# Altium project Dahlia Carrier Board.PrjPcb (part 1 of 4)
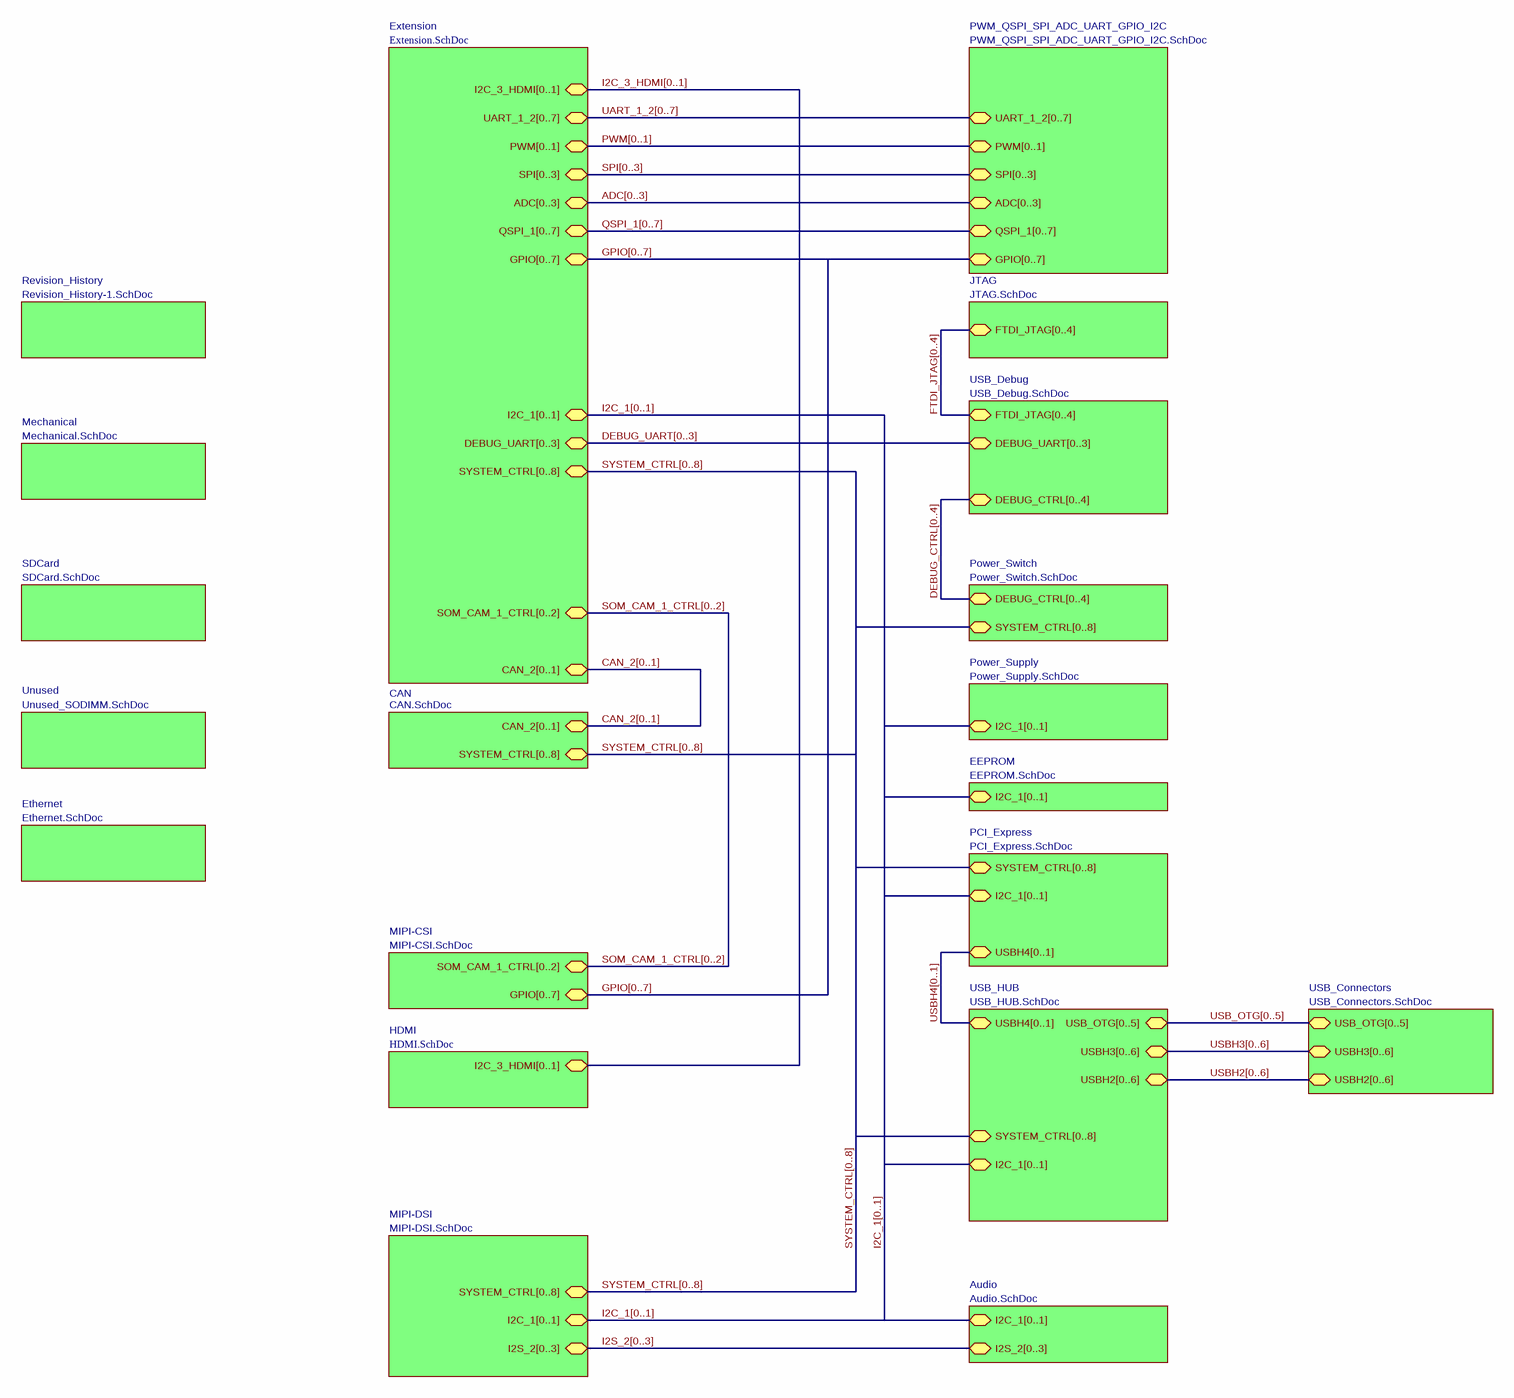
[diagram p0: Hardware_Architecture.SchDoc]
21 sheets, 885 parts. Net scope: global (net labels, ports and power ports of the same name join across sheets).
Board file: Dahlia Carrier Board.PcbDoc
Sheets:
  Hardware_Architecture.SchDoc
    Mechanical = Mechanical.SchDoc
    Revision_History = Revision_History-1.SchDoc
    CAN = CAN.SchDoc
    USB_HUB = USB_HUB.SchDoc
    USB_Connectors = USB_Connectors.SchDoc
    Power_Switch = Power_Switch.SchDoc
    SDCard = SDCard.SchDoc
    JTAG = JTAG.SchDoc
    Power_Supply = Power_Supply.SchDoc
    Ethernet = Ethernet.SchDoc
    PCI_Express = PCI_Express.SchDoc
    Audio = Audio.SchDoc
    MIPI-DSI = MIPI-DSI.SchDoc
    MIPI-CSI = MIPI-CSI.SchDoc
    PWM_QSPI_SPI_ADC_UART_GPIO_I2C = PWM_QSPI_SPI_ADC_UART_GPIO_I2C.SchDoc
    EEPROM = EEPROM.SchDoc
    USB_Debug = USB_Debug.SchDoc
    Extension = Extension.SchDoc
    Unused = Unused_SODIMM.SchDoc
    HDMI = HDMI.SchDoc

## Sheet Hardware_Architecture.SchDoc: Dahlia Carrier Board
size A3; Organization: Toradex AG; Address1: Ebenaustrasse 10; Address2: Horw; Address3: 6048; Address4: Switzerland; DocumentNumber: 1; Revision: V1.1; SheetNumber: 1; SheetTotal: 21; PageSetup: Record=PageOptions|CenterHorizontal=True|CenterVertical=True|PrintScale=0.73|XCorrection=1.00|YCorrection=1.00|PrintKind=0|BorderSize=5000000|LeftOffset=0|BottomOffset=0|Orientation=2|PaperLength=1000|PaperWidth=1000|Scale=100|PaperSource=7|PrintQuality=600|MediaType=1|DitherType=10|PaperKind=A4|PrintScaleMode=1

### Sub-sheets
Audio = Audio.SchDoc: I2C_1[0..1] (bidir), I2S_2[0..3] (bidir)
CAN = CAN.SchDoc: CAN_2[0..1] (bidir), SYSTEM_CTRL[0..8] (bidir)
EEPROM = EEPROM.SchDoc: I2C_1[0..1] (bidir)
Ethernet = Ethernet.SchDoc: no entries
Extension = Extension.SchDoc: ADC[0..3] (bidir), PWM[0..1] (bidir), SYSTEM_CTRL[0..8] (bidir), SPI[0..3] (bidir), DEBUG_UART[0..3] (bidir), CAN_2[0..1] (bidir), SOM_CAM_1_CTRL[0..2] (bidir), QSPI_1[0..7] (bidir), I2C_1[0..1] (bidir), UART_1_2[0..7] (bidir), I2C_3_HDMI[0..1] (bidir), GPIO[0..7] (bidir)
HDMI = HDMI.SchDoc: I2C_3_HDMI[0..1] (bidir)
JTAG = JTAG.SchDoc: FTDI_JTAG[0..4] (bidir)
Mechanical = Mechanical.SchDoc: no entries
MIPI-CSI = MIPI-CSI.SchDoc: GPIO[0..7] (bidir), SOM_CAM_1_CTRL[0..2] (bidir)
MIPI-DSI = MIPI-DSI.SchDoc: I2S_2[0..3] (bidir), SYSTEM_CTRL[0..8] (bidir), I2C_1[0..1] (bidir)
PCI_Express = PCI_Express.SchDoc: USBH4[0..1] (bidir), SYSTEM_CTRL[0..8] (bidir), I2C_1[0..1] (bidir)
Power_Supply = Power_Supply.SchDoc: I2C_1[0..1] (bidir)
Power_Switch = Power_Switch.SchDoc: DEBUG_CTRL[0..4] (bidir), SYSTEM_CTRL[0..8] (bidir)
PWM_QSPI_SPI_ADC_UART_GPIO_I2C = PWM_QSPI_SPI_ADC_UART_GPIO_I2C.SchDoc: PWM[0..1] (bidir), SPI[0..3] (bidir), ADC[0..3] (bidir), QSPI_1[0..7] (bidir), UART_1_2[0..7] (bidir), GPIO[0..7] (bidir)
Revision_History = Revision_History-1.SchDoc: no entries
SDCard = SDCard.SchDoc: no entries
Unused = Unused_SODIMM.SchDoc: no entries
USB_Connectors = USB_Connectors.SchDoc: USB_OTG[0..5] (bidir), USBH2[0..6] (bidir), USBH3[0..6] (bidir)
USB_Debug = USB_Debug.SchDoc: DEBUG_CTRL[0..4] (bidir), FTDI_JTAG[0..4] (bidir), DEBUG_UART[0..3] (bidir)
USB_HUB = USB_HUB.SchDoc: USB_OTG[0..5] (bidir), SYSTEM_CTRL[0..8] (bidir), I2C_1[0..1] (bidir), USBH2[0..6] (bidir), USBH4[0..1] (bidir), USBH3[0..6] (bidir)

### Buses and harness runs
bus ADC[0..3] = sheet Extension/ADC[0..3] = sheet PWM_QSPI_SPI_ADC_UART_GPIO_I2C/ADC[0..3]
bus CAN_2[0..1] = sheet CAN/CAN_2[0..1] = sheet Extension/CAN_2[0..1]
bus DEBUG_CTRL[0..4] = sheet Power_Switch/DEBUG_CTRL[0..4] = sheet USB_Debug/DEBUG_CTRL[0..4]
bus DEBUG_UART[0..3] = sheet Extension/DEBUG_UART[0..3] = sheet USB_Debug/DEBUG_UART[0..3]
bus FTDI_JTAG[0..4] = sheet JTAG/FTDI_JTAG[0..4] = sheet USB_Debug/FTDI_JTAG[0..4]
bus GPIO[0..7] = sheet Extension/GPIO[0..7] = sheet MIPI-CSI/GPIO[0..7] = sheet PWM_QSPI_SPI_ADC_UART_GPIO_I2C/GPIO[0..7]
bus I2C_1[0..1] = sheet Audio/I2C_1[0..1] = sheet EEPROM/I2C_1[0..1] = sheet Extension/I2C_1[0..1] = sheet MIPI-DSI/I2C_1[0..1] = sheet PCI_Express/I2C_1[0..1] = sheet Power_Supply/I2C_1[0..1] = sheet USB_HUB/I2C_1[0..1]
bus I2C_3_HDMI[0..1] = sheet Extension/I2C_3_HDMI[0..1] = sheet HDMI/I2C_3_HDMI[0..1]
bus I2S_2[0..3] = sheet Audio/I2S_2[0..3] = sheet MIPI-DSI/I2S_2[0..3]
bus PWM[0..1] = sheet Extension/PWM[0..1] = sheet PWM_QSPI_SPI_ADC_UART_GPIO_I2C/PWM[0..1]
bus QSPI_1[0..7] = sheet Extension/QSPI_1[0..7] = sheet PWM_QSPI_SPI_ADC_UART_GPIO_I2C/QSPI_1[0..7]
bus SOM_CAM_1_CTRL[0..2] = sheet Extension/SOM_CAM_1_CTRL[0..2] = sheet MIPI-CSI/SOM_CAM_1_CTRL[0..2]
bus SPI[0..3] = sheet Extension/SPI[0..3] = sheet PWM_QSPI_SPI_ADC_UART_GPIO_I2C/SPI[0..3]
bus SYSTEM_CTRL[0..8] = sheet CAN/SYSTEM_CTRL[0..8] = sheet Extension/SYSTEM_CTRL[0..8] = sheet MIPI-DSI/SYSTEM_CTRL[0..8] = sheet PCI_Express/SYSTEM_CTRL[0..8] = sheet Power_Switch/SYSTEM_CTRL[0..8] = sheet USB_HUB/SYSTEM_CTRL[0..8]
bus UART_1_2[0..7] = sheet Extension/UART_1_2[0..7] = sheet PWM_QSPI_SPI_ADC_UART_GPIO_I2C/UART_1_2[0..7]
bus USB_OTG[0..5] = sheet USB_Connectors/USB_OTG[0..5] = sheet USB_HUB/USB_OTG[0..5]
bus USBH2[0..6] = sheet USB_Connectors/USBH2[0..6] = sheet USB_HUB/USBH2[0..6]
bus USBH3[0..6] = sheet USB_Connectors/USBH3[0..6] = sheet USB_HUB/USBH3[0..6]
bus USBH4[0..1] = sheet PCI_Express/USBH4[0..1] = sheet USB_HUB/USBH4[0..1]

### Notes on the sheet
- Title
- Size:
- Date:
- A3
- Number:
- Time:
- Revision:
- Sheet
- of
- File:

## Sheet Mechanical.SchDoc: Dahlia Carrier Board
size A3; Organization: Toradex AG; Address1: Ebenaustrasse 10; Address2: Horw; Address3: 6048; Address4: Switzerland; DocumentNumber: 20; Revision: V1.1; SheetNumber: 20; SheetTotal: 21; PageSetup: Record=PageOptions|CenterHorizontal=True|CenterVertical=True|PrintScale=0.71|XCorrection=1.00|YCorrection=1.00|PrintKind=1|BorderSize=5000000|LeftOffset=0|BottomOffset=0|Orientation=2|PaperLength=1000|PaperWidth=1000|Scale=100|PaperSource=15|PrintQuality=600|MediaType=1|DitherType=10|PaperKind=A4|PrintScaleMode=1
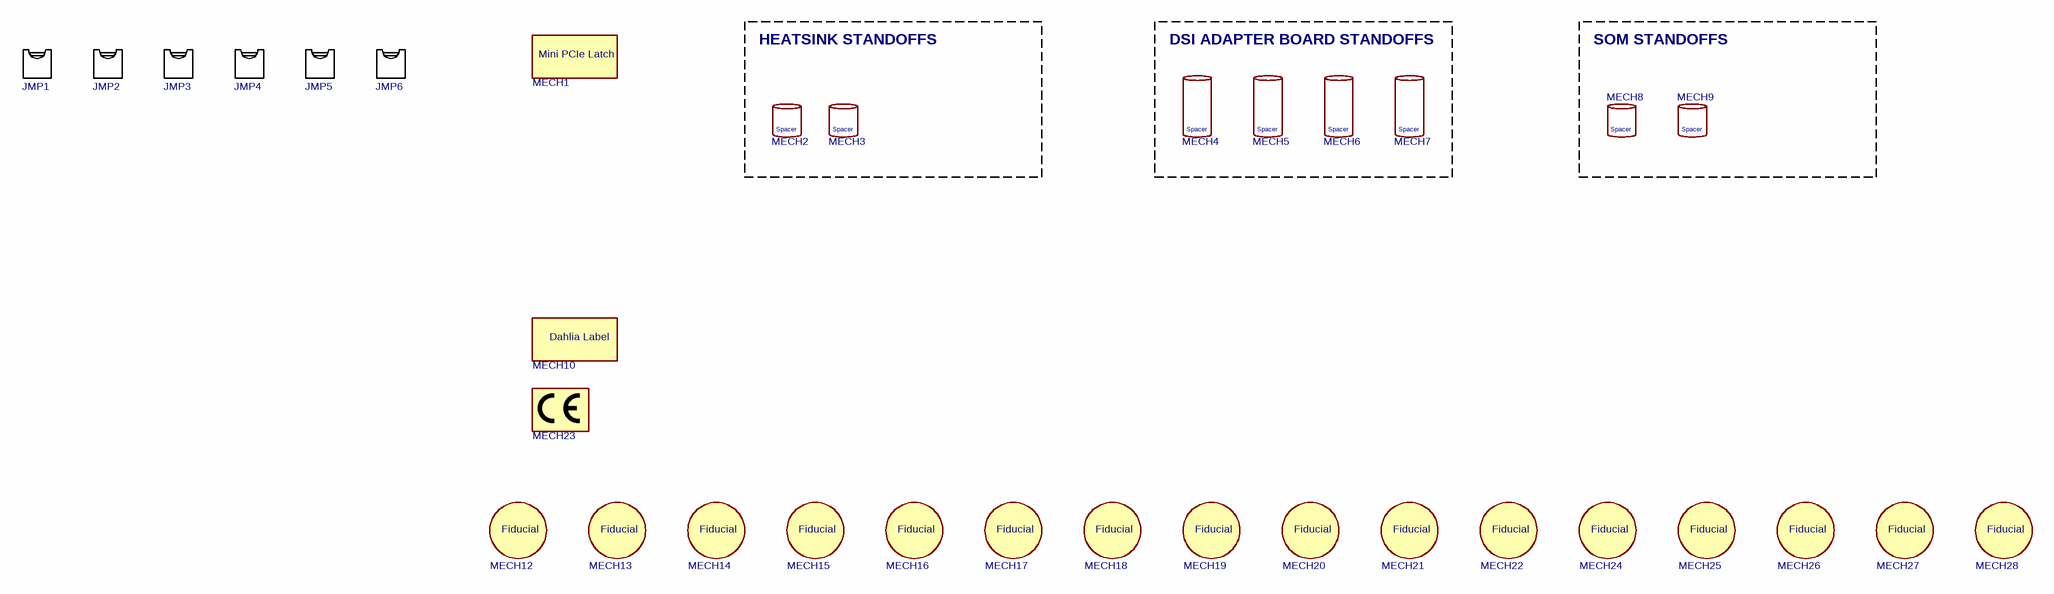
[diagram p1: Mechanical.SchDoc]

### Parts
JMP1  Shunt Jumper  (value not drawn)  (mechanical)
JMP2  Shunt Jumper  (value not drawn)  (mechanical)
JMP3  Shunt Jumper  (value not drawn)  (mechanical)
JMP4  Shunt Jumper  (value not drawn)  (mechanical)
JMP5  Shunt Jumper  (value not drawn)  (mechanical)
JMP6  Shunt Jumper  (value not drawn)  (mechanical)
MECH1  MECH-Mini-PCIe Latch  [MECH-Molex-48099-5701]  (value not drawn)
MECH2  Wurth-9774070243R  [MECH-Wurth-9774070243R]  (value not drawn)
MECH3  Wurth-9774070243R  [MECH-Wurth-9774070243R]  (value not drawn)
MECH4  Wurth-9774080360R  [MECH-Wurth-9774080360R]  (value not drawn)
MECH5  Wurth-9774080360R  [MECH-Wurth-9774080360R]  (value not drawn)
MECH6  Wurth-9774080360R  [MECH-Wurth-9774080360R]  (value not drawn)
MECH7  Wurth-9774080360R  [MECH-Wurth-9774080360R]  (value not drawn)
MECH8  Wurth-9774025243R  [MECH-Wurth-9774025243R]  (value not drawn)
MECH9  Wurth-9774025243R  [MECH-Wurth-9774025243R]  (value not drawn)
MECH10  Label-DahliaV1.1A  (value not drawn)  (mechanical)
MECH12  MECH-Fiducial  [T_Fiducial]  (value not drawn)  (no BOM)
MECH13  MECH-Fiducial  [T_Fiducial]  (value not drawn)  (no BOM)
MECH14  MECH-Fiducial  [T_Fiducial]  (value not drawn)  (no BOM)
MECH15  MECH-Fiducial  [T_Fiducial]  (value not drawn)  (no BOM)
MECH16  MECH-Fiducial  [T_Fiducial]  (value not drawn)  (no BOM)
MECH17  MECH-Fiducial  [T_Fiducial]  (value not drawn)  (no BOM)
MECH18  MECH-Fiducial  [T_Fiducial]  (value not drawn)  (no BOM)
MECH19  MECH-Fiducial  [T_Fiducial]  (value not drawn)  (no BOM)
MECH20  MECH-Fiducial  [T_Fiducial]  (value not drawn)  (no BOM)
MECH21  MECH-Fiducial  [T_Fiducial]  (value not drawn)  (no BOM)
MECH22  MECH-Fiducial  [T_Fiducial]  (value not drawn)  (no BOM)
MECH23  MECH-CE-Marking  [T_CE_Marking]  (value not drawn)  (no BOM)
MECH24  MECH-Fiducial  [T_Fiducial]  (value not drawn)  (no BOM)
MECH25  MECH-Fiducial  [T_Fiducial]  (value not drawn)  (no BOM)
MECH26  MECH-Fiducial  [T_Fiducial]  (value not drawn)  (no BOM)
MECH27  MECH-Fiducial  [T_Fiducial]  (value not drawn)  (no BOM)
MECH28  MECH-Fiducial  [T_Fiducial]  (value not drawn)  (no BOM)

### Blocks framed on the sheet
HEATSINK STANDOFFS: MECH2 MECH3
DSI ADAPTER BOARD STANDOFFS: MECH4-MECH7
SOM STANDOFFS: MECH8 MECH9

### Notes on the sheet
- Title
- Size:
- Date:
- A3
- Number:
- Time:
- Revision:
- Sheet
- of
- File:
- (in symbol MECH-Label-DahliaV1.1A) Dahlia Label
- (in symbol MECH-Molex-48099-5701) Mini PCIe Latch
- (in symbol MECH-Wurth-9774025243R) Spacer
- (in symbol MECH-Wurth-9774070243R) Spacer
- (in symbol MECH-Wurth-9774080360R) Spacer

### Library data of the parts
JMP1-JMP6 = MECH-Shunt-Jumper-Black-2.54mm: Manufacturer Name: JVE; Manufacturer Part No.: S1002-OPS60-01G
MECH1 = MECH-Molex-48099-5701: Mini-PCIe Latch; Manufacturer Name: Molex; Manufacturer Part No.: 48099-5701
MECH2 MECH3 = MECH-Wurth-9774070243R: Round Standoff M2x0.4 (7.00mm); Manufacturer Name: Wurth; Manufacturer Part No.: 9774070243R
MECH4-MECH7 = MECH-Wurth-9774080360R: Round Standoff M3x0.5 (8.00mm); Manufacturer Name: Wurth; Manufacturer Part No.: 9774080360R
MECH8 MECH9 = MECH-Wurth-9774025243R: Round Standoff M2x0.4 (2.50mm); Manufacturer Name: Wurth; Manufacturer Part No.: 9774025243R
MECH10 = MECH-Label-DahliaV1.1A: Label Sticker Dahlia V1.1A
MECH12-MECH22 MECH24-MECH28 = MECH-Fiducial: Fiducial
MECH23 = MECH-CE-Marking: CE Marking

## Sheet Revision_History-1.SchDoc: Dahlia Carrier Board
size A3; Organization: Toradex AG; Address1: Ebenaustrasse 10; Address2: Horw; Address3: 6048; Address4: Switzerland; DocumentNumber: 2; Revision: V1.1; SheetNumber: 2; SheetTotal: 21; PageSetup: Record=PageOptions|CenterHorizontal=True|CenterVertical=True|PrintScale=0.73|XCorrection=1.00|YCorrection=1.00|PrintKind=0|BorderSize=5000000|LeftOffset=0|BottomOffset=0|Orientation=2|PaperLength=1000|PaperWidth=1000|Scale=100|PaperSource=7|PrintQuality=-4|MediaType=1|DitherType=10|PaperKind=A4|PrintScaleMode=1
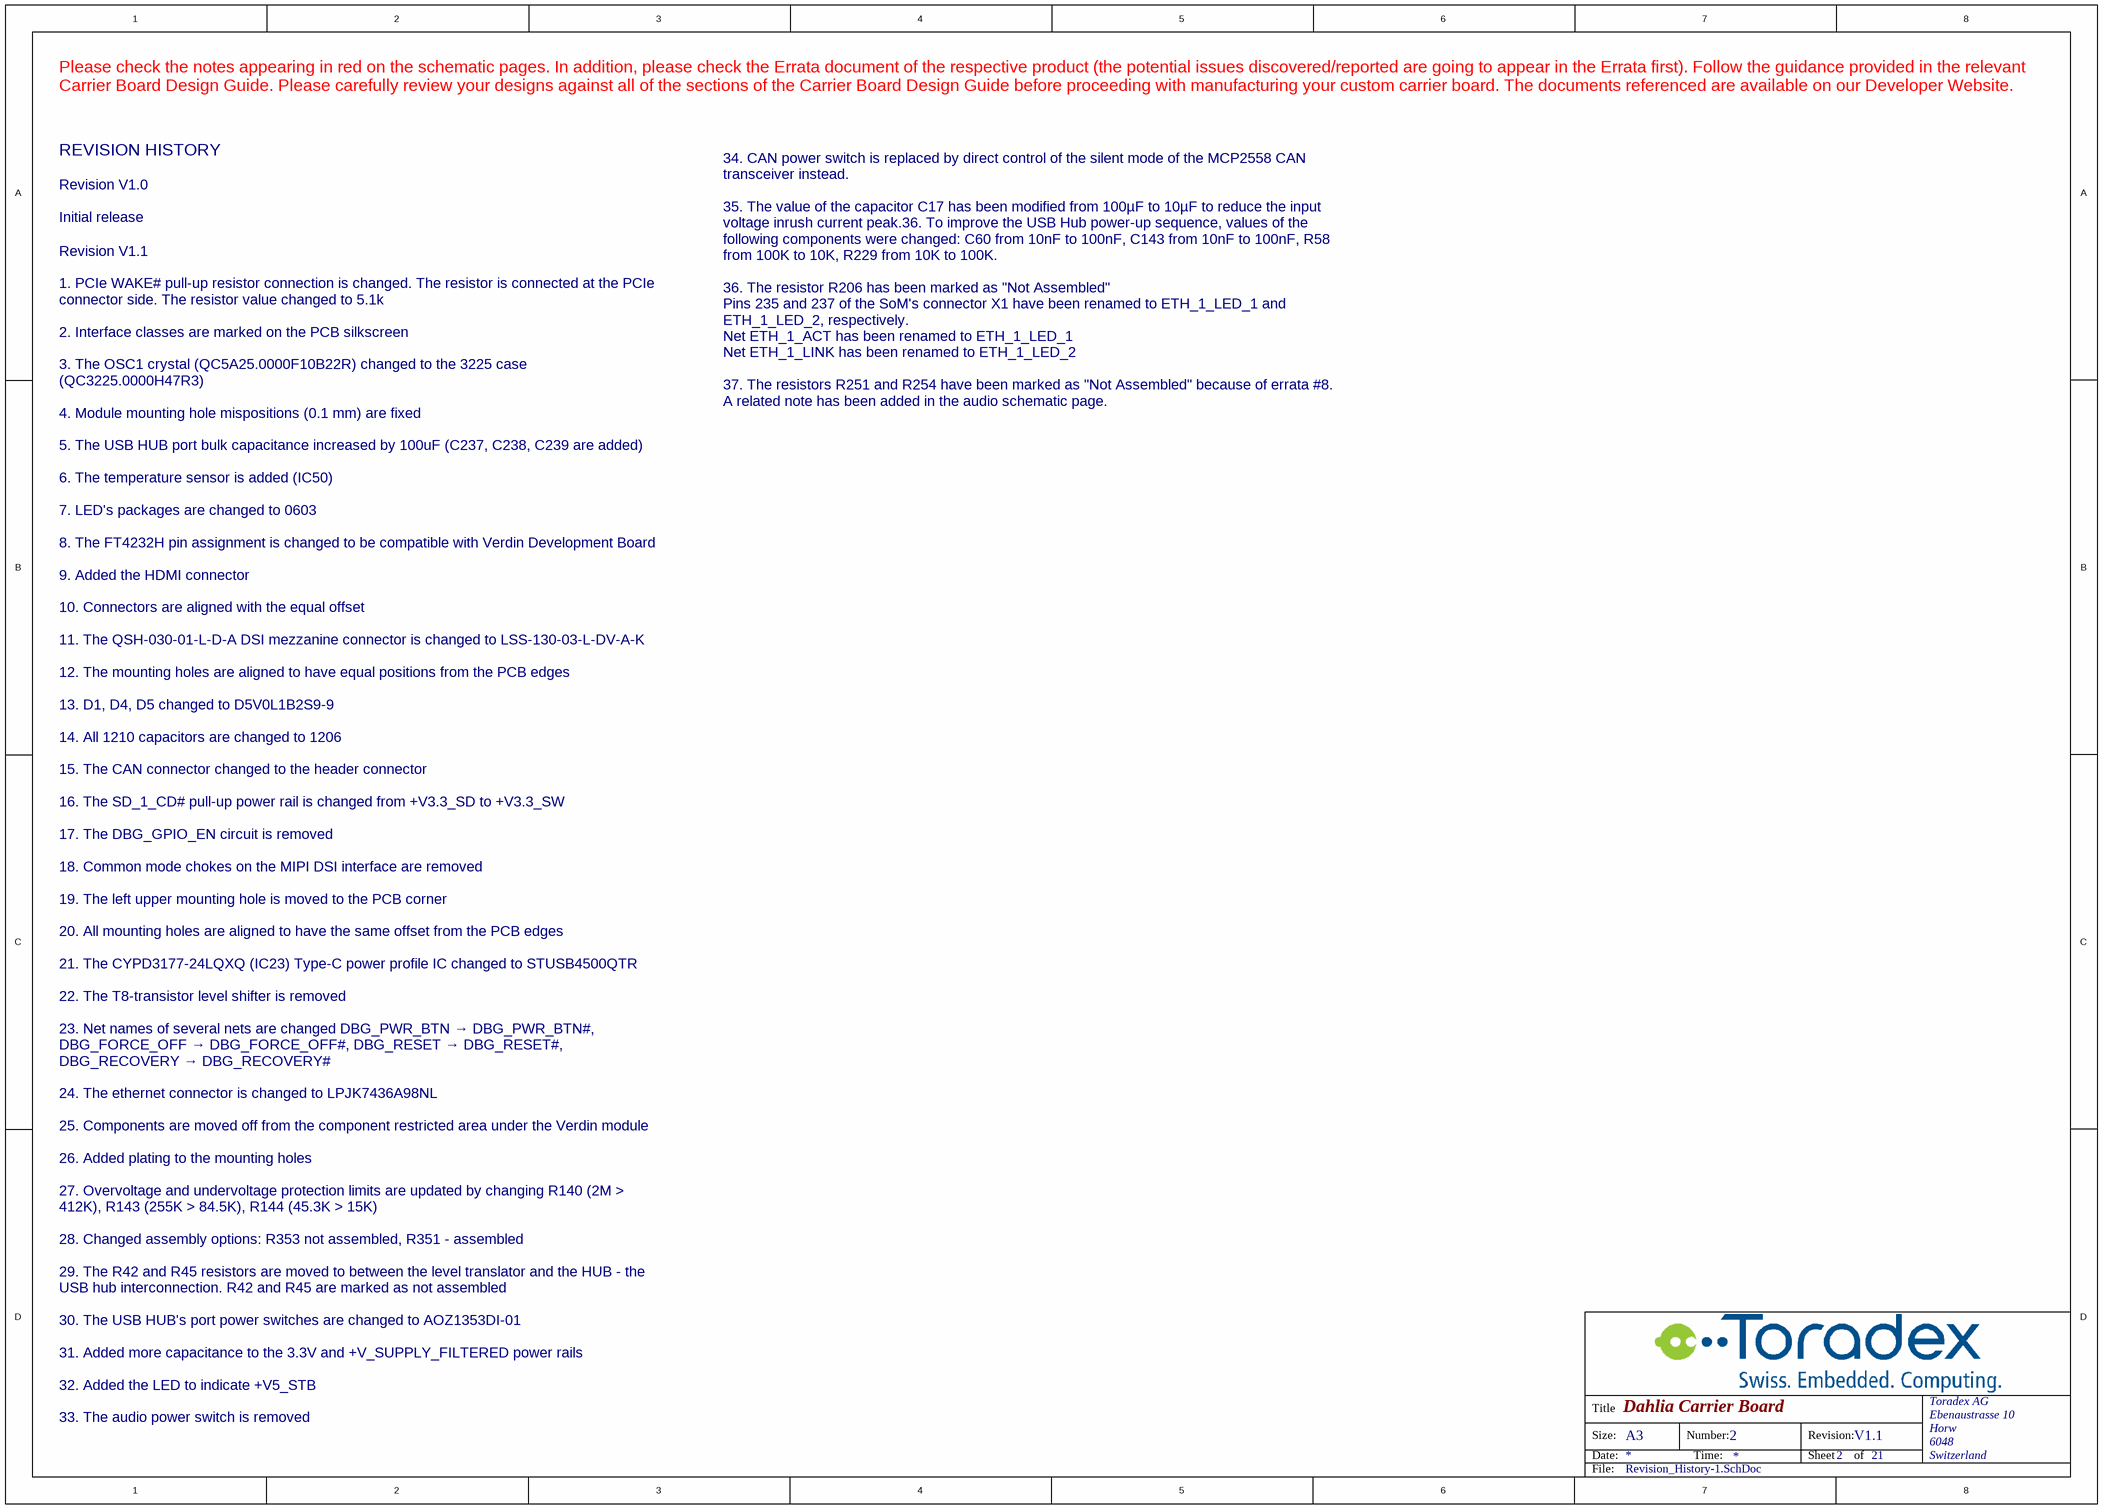
[diagram p2: Revision_History-1.SchDoc]

### Notes on the sheet
- Please check the notes appearing in red on the schematic pages. In addition, please check the Errata document of the respective product (the potential issues discovered/reported are going to appear in the Errata first). Follow the guidance provided in the relevant Carrier Board Design Guide. Please carefully review your designs against all of the sections of the Carrier Board Design Guide before proceeding with manufacturing your custom carrier board. The documents referenced are available on our Developer Website.
- REVISION HISTORY
- Revision V1.0
  Initial release
- 34. CAN power switch is replaced by direct control of the silent mode of the MCP2558 CAN transceiver instead.
  35. The value of the capacitor C17 has been modified from 100µF to 10µF to reduce the input voltage inrush current peak.36. To improve the USB Hub power-up sequence, values of the following components were changed: C60 from 10nF to 100nF, C143 from 10nF to 100nF, R58 from 100K to 10K, R229 from 10K to 100K.
  36. The resistor R206 has been marked as "Not Assembled"
  Pins 235 and 237 of the SoM's connector X1 have been renamed to ETH_1_LED_1 and ETH_1_LED_2, respectively.
  Net ETH_1_ACT has been renamed to ETH_1_LED_1
  Net ETH_1_LINK has been renamed to ETH_1_LED_2
  37. The resistors R251 and R254 have been marked as "Not Assembled" because of errata #8. A related note has been added in the audio schematic page.
- Revision V1.1
  1. PCIe WAKE# pull-up resistor connection is changed. The resistor is connected at the PCIe connector side. The resistor value changed to 5.1k
  2. Interface classes are marked on the PCB silkscreen
  3. The OSC1 crystal (QC5A25.0000F10B22R) changed to the 3225 case (QC3225.0000H47R3)
  4. Module mounting hole mispositions (0.1 mm) are fixed
  5. The USB HUB port bulk capacitance increased by 100uF (C237, C238, C239 are added)
  6. The temperature sensor is added (IC50)
  7. LED's packages are changed to 0603
  8. The FT4232H pin assignment is changed to be compatible with Verdin Development Board
  9. Added the HDMI connector
  10. Connectors are aligned with the equal offset
  11. The QSH-030-01-L-D-A DSI mezzanine connector is changed to LSS-130-03-L-DV-A-K
  12. The mounting holes are aligned to have equal positions from the PCB edges
  13. D1, D4, D5 changed to D5V0L1B2S9-9
  14. All 1210 capacitors are changed to 1206
  15. The CAN connector changed to the header connector
  16. The SD_1_CD# pull-up power rail is changed from +V3.3_SD to +V3.3_SW
  17. The DBG_GPIO_EN circuit is removed
  18. Common mode chokes on the MIPI DSI interface are removed
  19. The left upper mounting hole is moved to the PCB corner
  20. All mounting holes are aligned to have the same offset from the PCB edges
  21. The CYPD3177-24LQXQ (IC23) Type-C power profile IC changed to STUSB4500QTR
  22. The T8-transistor level shifter is removed
  23. Net names of several nets are changed DBG_PWR_BTN → DBG_PWR_BTN#, DBG_FORCE_OFF → DBG_FORCE_OFF#, DBG_RESET → DBG_RESET#, DBG_RECOVERY → DBG_RECOVERY#
  24. The ethernet connector is changed to LPJK7436A98NL
  25. Components are moved off from the component restricted area under the Verdin module
  26. Added plating to the mounting holes
  27. Overvoltage and undervoltage protection limits are updated by changing R140 (2M > 412K), R143 (255K > 84.5K), R144 (45.3K > 15K)
  28. Changed assembly options: R353 not assembled, R351 - assembled
  29. The R42 and R45 resistors are moved to between the level translator and the HUB - the USB hub interconnection. R42 and R45 are marked as not assembled
  30. The USB HUB's port power switches are changed to AOZ1353DI-01
  31. Added more capacitance to the 3.3V and +V_SUPPLY_FILTERED power rails
  32. Added the LED to indicate +V5_STB
  33. The audio power switch is removed
- Title
- Size:
- Date:
- A3
- Number:
- Time:
- Revision:
- Sheet
- of
- File:

## Sheet CAN.SchDoc: Dahlia Carrier Board
size A3; Organization: Toradex AG; Address1: Ebenaustrasse 10; Address2: Horw; Address3: 6048; Address4: Switzerland; DocumentNumber: 13; Revision: V1.1; SheetNumber: 13; SheetTotal: 21; PageSetup: Record=PageOptions|CenterHorizontal=True|CenterVertical=True|PrintScale=0.71|XCorrection=1.00|YCorrection=1.00|PrintKind=1|BorderSize=5000000|LeftOffset=0|BottomOffset=0|Orientation=2|PaperLength=1000|PaperWidth=1000|Scale=100|PaperSource=15|PrintQuality=600|MediaType=1|DitherType=10|PaperKind=A4|PrintScaleMode=1
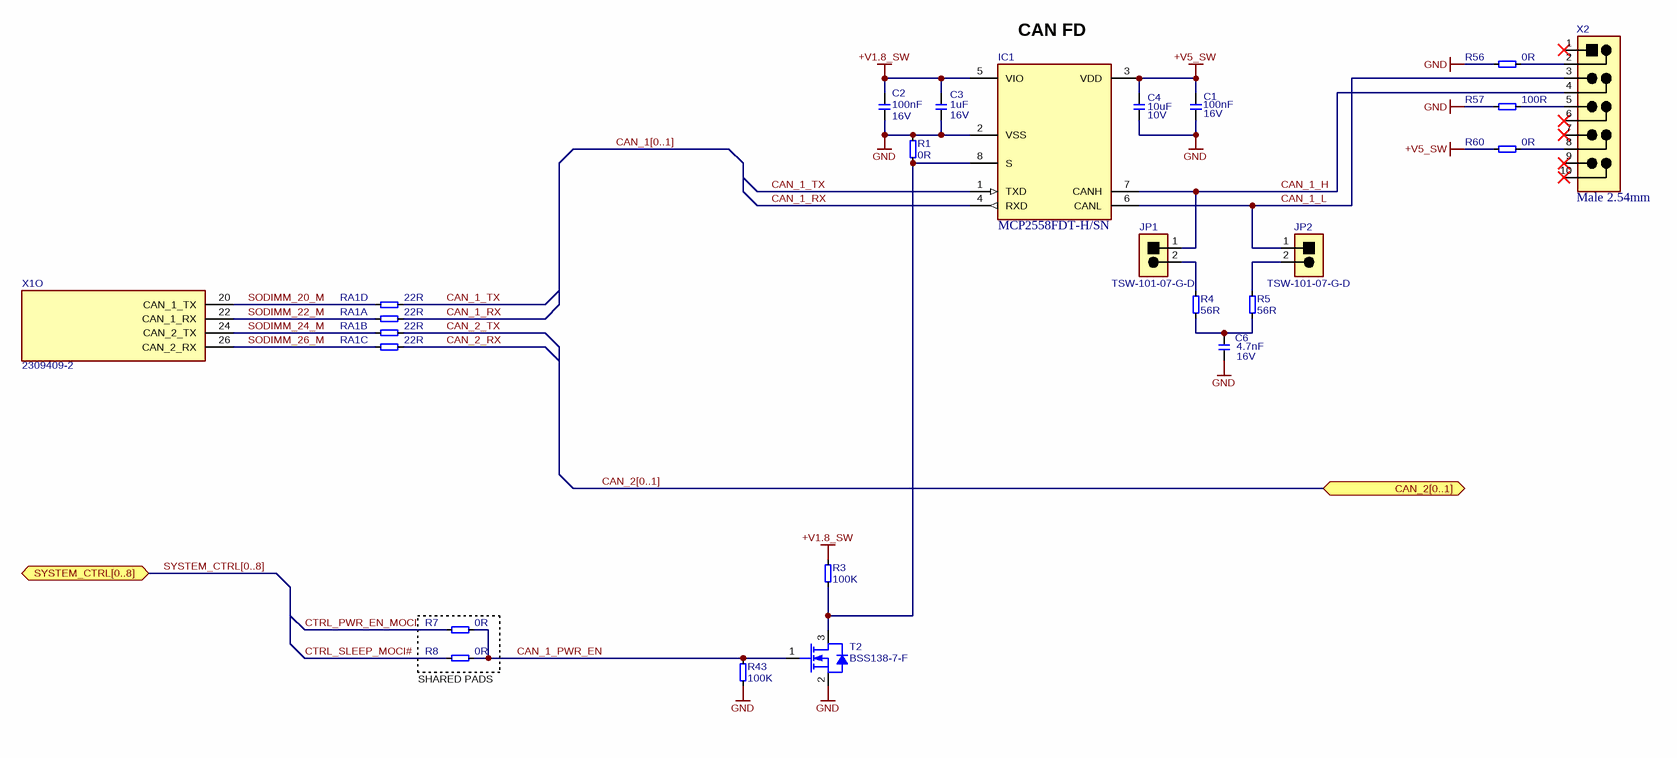
[diagram p3: CAN.SchDoc]

### Parts
C1  Rating: 16V  [CAPC1005X60N]  (hidden comment: 100nF)
C2  Rating: 16V  [CAPC1005X60N]  (hidden comment: 100nF)
C3  Rating: 16V  [CAPC1005X60N]  (hidden comment: 1uF)
C4  Rating: 10V  [T_CAPC0603X33N]  (hidden comment: 10uF)
C6  Rating: 16V  [T_CAPC0603X33N]  (hidden comment: 4.7nF)
IC1  MCP2558FDT-H/SN  [IC-SOIC-8]
JP1  TSW-101-07-G-D  [T_Samtec_TSW-101-07-G-D]
JP2  TSW-101-07-G-D  [T_Samtec_TSW-101-07-G-D]
R1  0R  [T_RESC0603X30N]
R3  100K  [RESC1005X40N]
R4  56R  [T_RESC0603X30N]
R5  56R  [T_RESC0603X30N]
R7  0R  [T_RESC0603X30N]
R8  0R  [T_RESC0603X30N]
R43  100K  [RESC1005X40N]
R56  0R  [T_RESC0603X30N]
R57  100R  [T_RESC0603X30N]
R60  0R  [T_RESC0603X30N]
RA1  22R  [T_Resistor_Array_X4]  (parts A,B,C,D of 4)
T2  BSS138-7-F  [SOT95P237X112-3N]
X1  2309409-2  [CON-TE-2309409-2-SOLDERABLE-STANDOFFS]  (part O of 23)
X2  Male 2.54mm  [CON-Header-2x5-Male-2.54mm]

### Ports
CAN_2[0..1] (bidir), SYSTEM_CTRL[0..8] (bidir)

### Nets
+V1.8_SW: C2.2 C3.2 IC1.5(VIO) R3.1
+V5_SW: C1.2 C4.2 IC1.3(VDD) R60.2
GND: C1.1 C2.1 C3.1 C4.1 C6.1 IC1.2(VSS) R1.2 R43.2 R56.2 R57.1 T2.2(S)
CAN_1_H: IC1.7(CANH) JP1.1 X2.4
CAN_1_L: IC1.6(CANL) JP2.1 X2.3
CAN_1_PWR_EN: R7.2 R8.2 R43.1 T2.1(G)
CAN_1_RX: IC1.4(RXD) RA1.5
CAN_1_TX: IC1.1(TXD) RA1.8
CAN_2_RX: RA1.7
CAN_2_TX: RA1.6
CTRL_PWR_EN_MOCI: R7.1
CTRL_SLEEP_MOCI#: R8.1
SODIMM_20_M: RA1.4 X1.20(CAN_1_TX)
SODIMM_22_M: RA1.1 X1.22(CAN_1_RX)
SODIMM_24_M: RA1.2 X1.24(CAN_2_TX)
SODIMM_26_M: RA1.3 X1.26(CAN_2_RX)
NetC6_2: C6.2 R4.1 R5.1
NetIC1_8: IC1.8(S) R1.1 R3.2 T2.3(D)
NetJP1_2: JP1.2 R4.2
NetJP2_2: JP2.2 R5.2
NetR56_1: R56.1 X2.2
NetR57_2: R57.2 X2.5
NetR60_1: R60.1 X2.8

Not connected (* = marked no-connect by the designer): X2 1* 6* 7* 9* 10*

### Buses and harness runs
bus CAN_1[0..1]
bus CAN_2[0..1] = port CAN_2[0..1]
bus SYSTEM_CTRL[0..8] = port SYSTEM_CTRL[0..8]

### Notes on the sheet
- (near IC1) CAN FD
- (near R8) SHARED PADS
- Title
- Size:
- Date:
- A3
- Number:
- Time:
- Revision:
- Sheet
- of
- File:

### Library data of the parts
C1 C2 = C-X7R-100nF-16V-10%-0402: Capacitor Ceramic X7R 100nF 16V 10% 0402; Tolerance: 10%; Type: X7R; Value: 100nF
C3 = C-X5R-1uF-16V-20%-0402: Capacitor Ceramic X5R 1uF 16V 20% 0402; Tolerance: 20%; Type: X5R; Value: 1uF
C4 = C-X5R-10uF-10V-20%-0603: Capacitor Ceramic X5R 10uF 10V 20% 0603; Tolerance: 20%; Type: X5R; Value: 10uF
C6 = C-X7R-4.7nF-16V-10%-0603: Capacitor Ceramic X7R 4.7nF 16V 10% 0603; Type: X7R; Tolerance: 10%; Value: 4.7nF
IC1 = IC-Microchip-MCP2558FDT-H/SN: CAN FD Transceiver with Silent Mode; Manufacturer Name: Microchip; Temperature Range: -40C to +150C; Package: SOIC-8; Manufacturer Part No.: MCP2558FDT-H/SN
JP1 JP2 = CON-Samtec-TSW-101-07-G-D: Header male, 1x2 Pins, 2.54 mm pitch; Manufacturer Name: Samtec; Pitch: 2.54 mm; No. of ways: 1x2; Manufacturer Part no.: TSW-101-07-G-D
R1 R7 R8 R56 R60 = R-0R-63mW-1%-0603: Resistor 0 ohm 63mW 1% 0603; Rating: 63mW; Tolerance: 1%; Value: 0R
R3 R43 = R-100K-63mW-5%-0402: Resistor 100 Kohm 63mW 5% 0402; Rating: 63mW; Tolerance: 5%; Value: 100K
R4 R5 = R-56R-125mW-1%-0603: Resistor 56 ohm 125mW 1% 0603; Rating: 125mW; Tolerance: 1%; Value: 56R
R57 = R-100R-63mW-5%-0603: Resistor 100 ohm 63mW 5% 0603; Rating: 63mW; Tolerance: 5%; Value: 100R
RA1 = RA-22R-63mW-5%-1206-div: Resistor Array 22 R 63mW 5% 1206; Tolerance: 5%; Power Dissipation: 63mW; Value: 22R
T2 = T-Diodes-BSS138-7-F: N-channel MOSFET, BSS138-7-F; Manufacturer Name: Diodes; Manufacturer Part No.: BSS138-7-F
X1 = CON-TE-2309409-2: DDR4 SODIMM Socket, 260 pins, 5.2mm(H), 0.5mm Pitch; Manufacturer Name: TE; Temperature Range: -40C to +125C; Package: DDR4-SODIMM-260; Manufacturer Part No.: 2309409-2
X2 = CON-Header-2x5-Male-2.54mm: Header Male, 2x5 Pins, 2.54mm pitch; Manufacturer Name: FCI; Manufacturer Part No.: 77313-101-10LF; No. of ways: 10

## Sheet USB_HUB.SchDoc: Dahlia Carrier Board
size A3; Organization: Toradex AG; Address1: Ebenaustrasse 10; Address2: Horw; Address3: 6048; Address4: Switzerland; DocumentNumber: 5; Revision: V1.1; SheetNumber: 5; SheetTotal: 21; PageSetup: Record=PageOptions|CenterHorizontal=True|CenterVertical=True|PrintScale=0.71|XCorrection=1.00|YCorrection=1.00|PrintKind=1|BorderSize=5000000|LeftOffset=0|BottomOffset=0|Orientation=2|PaperLength=1000|PaperWidth=1000|Scale=100|PaperSource=15|PrintQuality=600|MediaType=1|DitherType=10|PaperKind=A4|PrintScaleMode=1
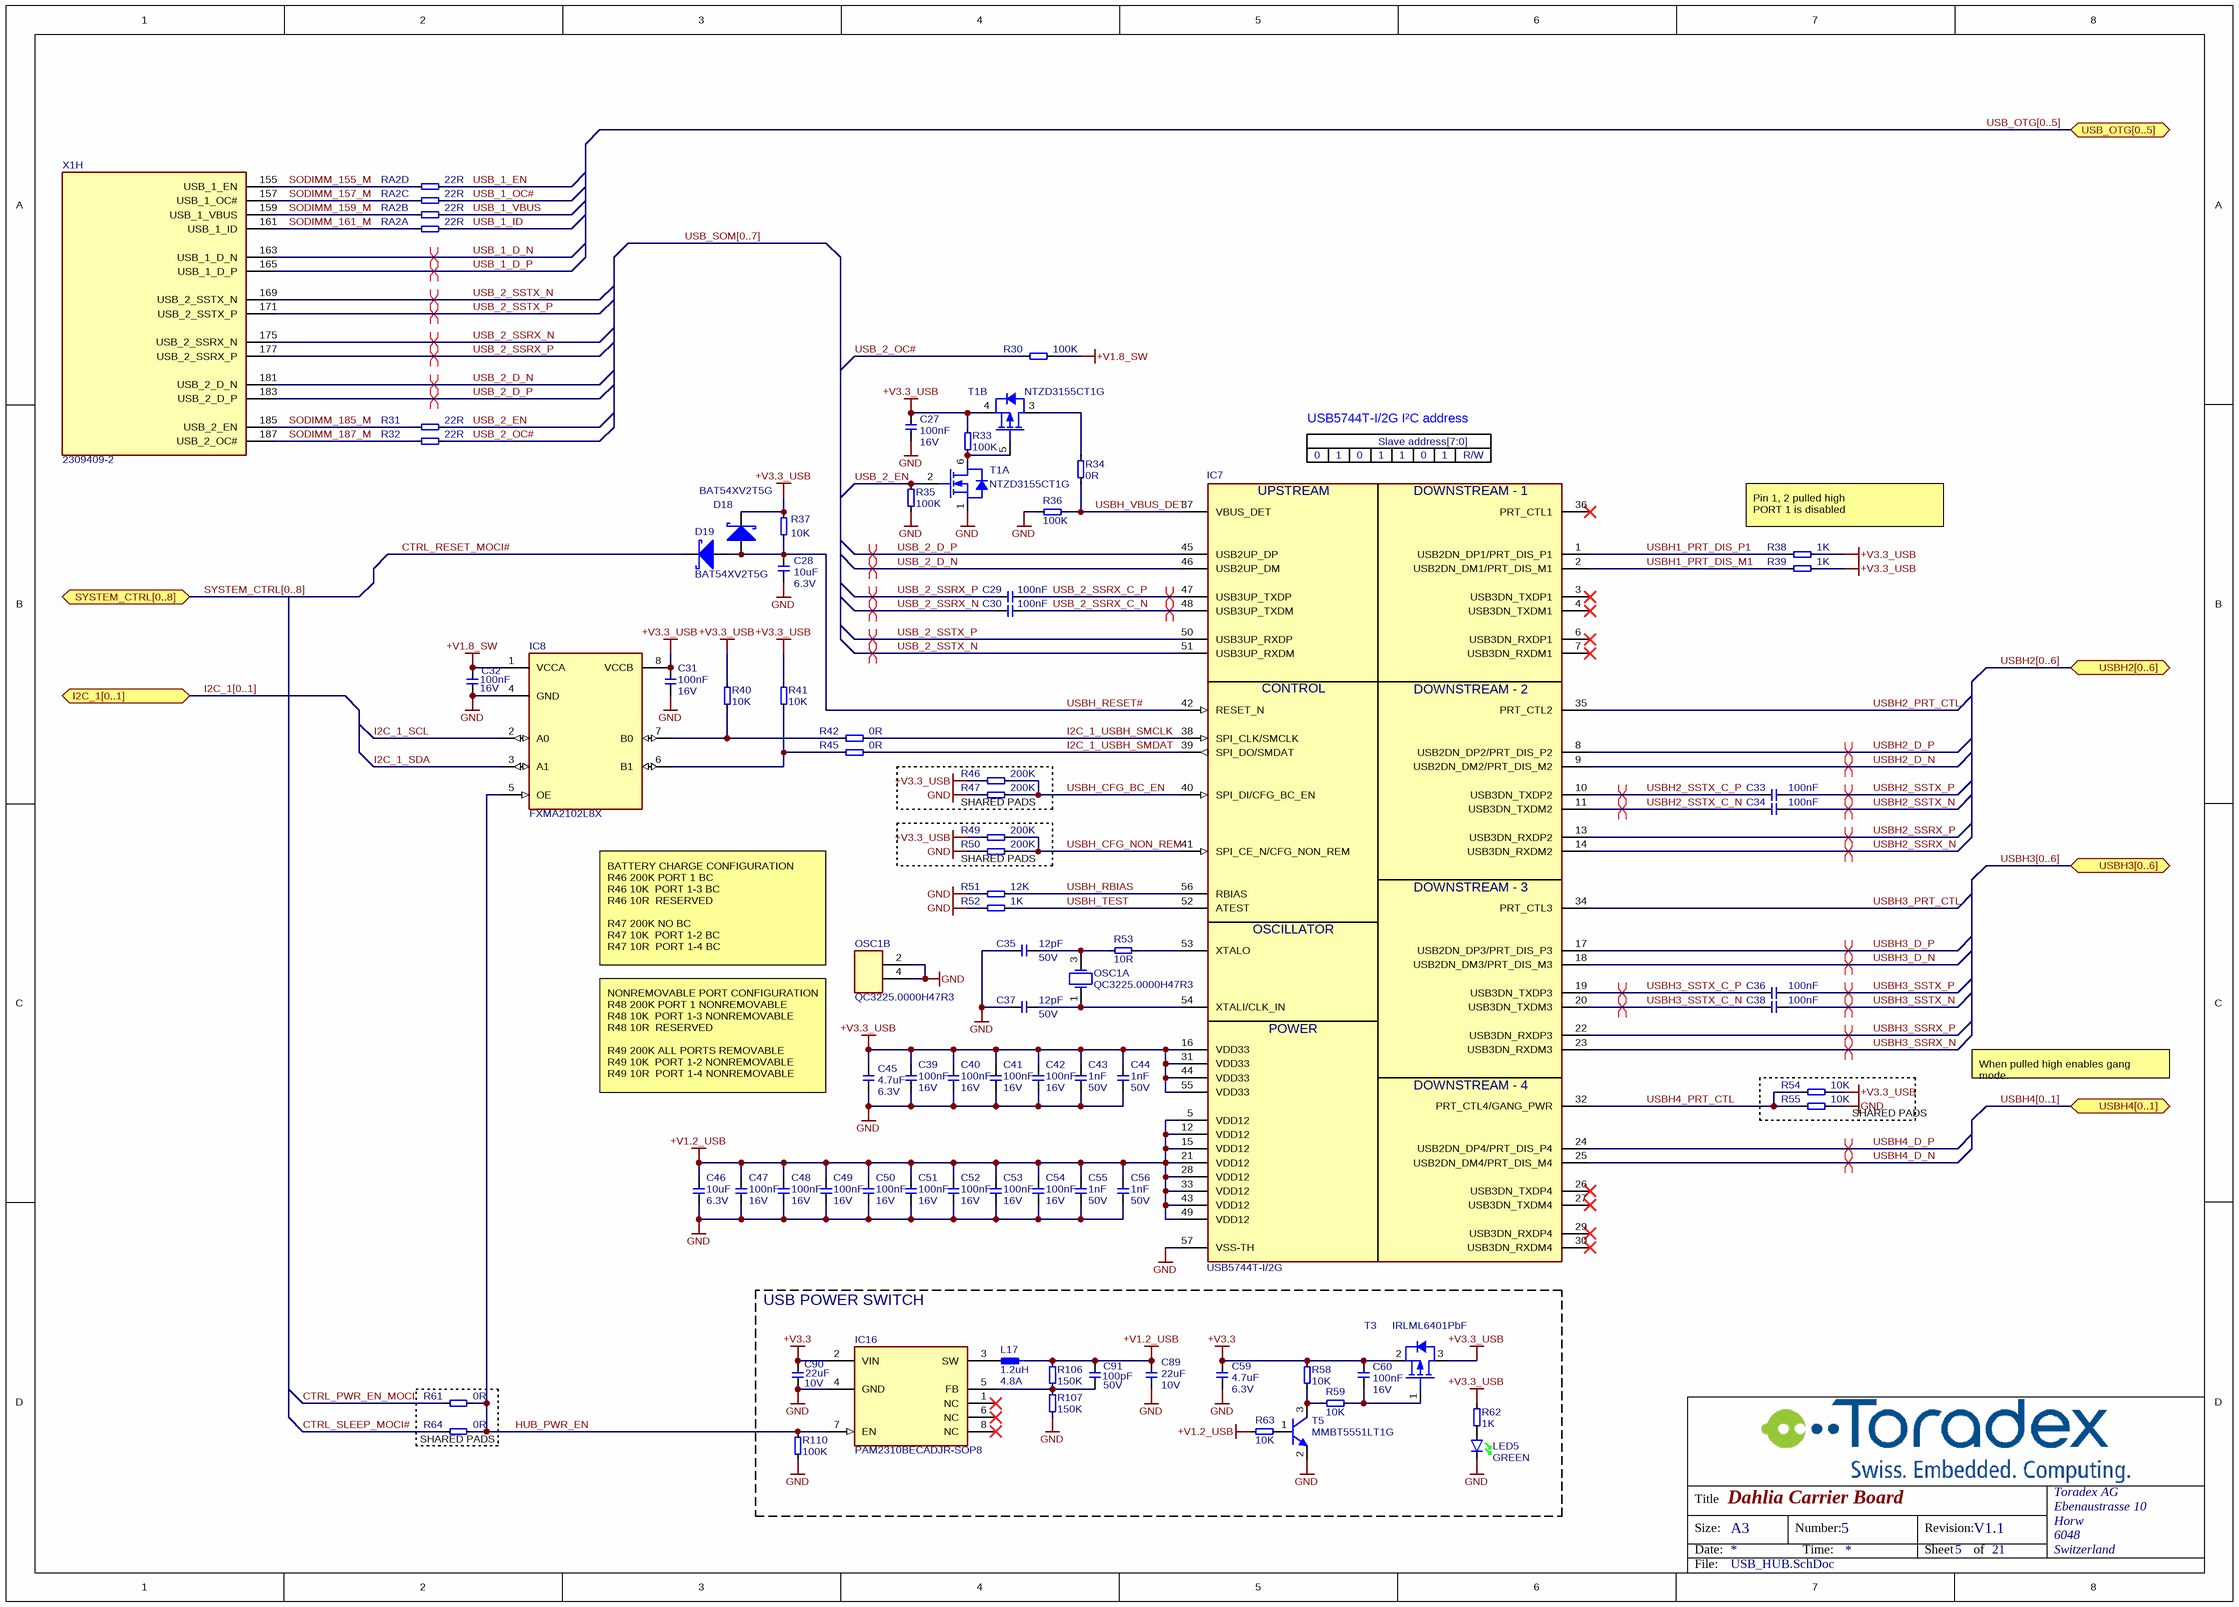
[diagram p4: USB_HUB.SchDoc]

### Parts
C27  Rating: 16V  [CAPC1005X60N]  (hidden comment: 100nF)
C28  Rating: 6.3V  [CAPC1005X60N]  (hidden comment: 10uF)
C29  100nF  [CAPC1005X60N]
C30  100nF  [CAPC1005X60N]
C31  Rating: 16V  [CAPC1005X60N]  (hidden comment: 100nF)
C32  Rating: 16V  [CAPC1005X60N]  (hidden comment: 100nF)
C33  100nF  [CAPC1005X60N]
C34  100nF  [CAPC1005X60N]
C35  Rating: 50V  [CAPC1005X60N]  (hidden comment: 12pF)
C36  100nF  [CAPC1005X60N]
C37  Rating: 50V  [CAPC1005X60N]  (hidden comment: 12pF)
C38  100nF  [CAPC1005X60N]
C39  Rating: 16V  [CAPC1005X60N]  (hidden comment: 100nF)
C40  Rating: 16V  [CAPC1005X60N]  (hidden comment: 100nF)
C41  Rating: 16V  [CAPC1005X60N]  (hidden comment: 100nF)
C42  Rating: 16V  [CAPC1005X60N]  (hidden comment: 100nF)
C43  Rating: 50V  [CAPC1005X60N]  (hidden comment: 1nF)
C44  Rating: 50V  [CAPC1005X60N]  (hidden comment: 1nF)
C45  Rating: 6.3V  [CAPC1005X60N]  (hidden comment: 4.7uF)
C46  Rating: 6.3V  [CAPC1005X60N]  (hidden comment: 10uF)
C47  Rating: 16V  [CAPC1005X60N]  (hidden comment: 100nF)
C48  Rating: 16V  [CAPC1005X60N]  (hidden comment: 100nF)
C49  Rating: 16V  [CAPC1005X60N]  (hidden comment: 100nF)
C50  Rating: 16V  [CAPC1005X60N]  (hidden comment: 100nF)
C51  Rating: 16V  [CAPC1005X60N]  (hidden comment: 100nF)
C52  Rating: 16V  [CAPC1005X60N]  (hidden comment: 100nF)
C53  Rating: 16V  [CAPC1005X60N]  (hidden comment: 100nF)
C54  Rating: 16V  [CAPC1005X60N]  (hidden comment: 100nF)
C55  Rating: 50V  [CAPC1005X60N]  (hidden comment: 1nF)
C56  Rating: 50V  [CAPC1005X60N]  (hidden comment: 1nF)
C59  Rating: 6.3V  [CAPC1005X60N]  (hidden comment: 4.7uF)
C60  Rating: 16V  [CAPC1005X60N]  (hidden comment: 100nF)
C89  Rating: 10V  [T_CAPC0805X125N]  (hidden comment: 22uF)
C90  Rating: 10V  [T_CAPC0805X125N]  (hidden comment: 22uF)
C91  Rating: 50V  [CAPC1005X60N]  (hidden comment: 100pF)
D18  BAT54XV2T5G  [SOD-523]
D19  BAT54XV2T5G  [SOD-523]
IC7  USB5744T-I/2G  [IC-QFN40P700X700X100_HS-57N]
IC8  FXMA2102L8X  [IC-MicroPak50P160X2160X55-8N]
IC16  Manufacturer Part No.: PAM2310BECADJR-SOP8  [IC-SO-8EP]  (hidden comment: PAM2310BECADJR)
L17  Rating: 4.8A  [IND-BOURNS-SRP4020TA]  (hidden comment: 1.2uH)
LED5  Color: GREEN  [T_Liteon_LTST-C190GKT]  (hidden comment: LTST-C190GKT)
OSC1  QC3225.0000H47R3  [OSC-SMD-3.2mmx2.5mm]  (parts A,B of 2)
R30  100K  [RESC1005X40N]
R31  22R  [RESC1005X40N]
R32  22R  [RESC1005X40N]
R33  100K  [RESC1005X40N]
R34  0R  [T_RESC0603X30N]
R35  100K  [RESC1005X40N]
R36  100K  [RESC1005X40N]
R37  10K  [RESC1005X40N]
R38  1K  [RESC1005X40N]
R39  1K  [RESC1005X40N]
R40  10K  [RESC1005X40N]
R41  10K  [RESC1005X40N]
R42  0R  [T_RESC0603X30N]
R45  0R  [T_RESC0603X30N]
R46  200K  [T_RESC0603X30N]
R47  200K  [T_RESC0603X30N]
R49  200K  [T_RESC0603X30N]
R50  200K  [T_RESC0603X30N]
R51  12K  [RESC1005X40N]
R52  1K  [RESC1005X40N]
R53  10R  [RESC1005X40N]
R54  10K  [T_RESC0603X30N]
R55  10K  [T_RESC0603X30N]
R58  10K  [RESC1005X40N]
R59  10K  [RESC1005X40N]
R61  0R  [T_RESC0603X30N]
R62  1K  [RESC1005X40N]
R63  10K  [RESC1005X40N]
R64  0R  [T_RESC0603X30N]
R106  150K  [RESC1005X40N]
R107  150K  [RESC1005X40N]
R110  100K  [RESC1005X40N]
RA2  22R  [T_Resistor_Array_X4]  (parts A,B,C,D of 4)
T1  NTZD3155CT1G  [SOTFL50P160X60-6N]  (parts A,B of 2)
T3  IRLML6401PbF  [SOT95P237X112-3N]
T5  MMBT5551LT1G  [ONSC-SOT-23-3-318-08_V]
X1  2309409-2  [CON-TE-2309409-2-SOLDERABLE-STANDOFFS]  (part H of 23)

### Blocks framed on the sheet
SHARED PADS: R46 R47
SHARED PADS: R54 R55
USB POWER SWITCH: C59 C60 C89-C91 IC16 L17 LED5 R58 R59 R62 R63 R106 R107 R110 T3 T5
SHARED PADS: R61 R64

### Ports
I2C_1[0..1] (bidir), SYSTEM_CTRL[0..8] (bidir), USB_OTG[0..5] (bidir), USBH2[0..6] (bidir), USBH3[0..6] (bidir), USBH4[0..1] (bidir)

### Nets
+V1.2_USB: C46.2 C47.2 C48.2 C49.2 C50.2 C51.2 C52.2 C53.2 C54.2 C55.2 C56.2 C89.2 C91.2 IC7.5(VDD12) IC7.12(VDD12) IC7.15(VDD12) IC7.21(VDD12) IC7.28(VDD12) IC7.33(VDD12) IC7.43(VDD12) IC7.49(VDD12) L17.2 R63.2 R106.2
+V1.8_SW: C32.2 IC8.1(VCCA) R30.2
+V3.3: C59.2 C60.2 C90.2 IC16.2(VIN) R58.2 T3.2(S)
+V3.3_USB: C27.2 C31.2 C39.2 C40.2 C41.2 C42.2 C43.2 C44.2 C45.2 D18.C IC7.16(VDD33) IC7.31(VDD33) IC7.44(VDD33) IC7.55(VDD33) IC8.8(VCCB) R33.2 R37.2 R38.2 R39.2 R40.2 R41.2 R46.1 R49.1 R54.2 R62.2 T1.4(S) T3.3(D)
GND: C27.1 C28.1 C31.1 C32.1 C35.2 C37.2 C39.1 C40.1 C41.1 C42.1 C43.1 C44.1 C45.1 C46.1 C47.1 C48.1 C49.1 C50.1 C51.1 C52.1 C53.1 C54.1 C55.1 C56.1 C59.1 C89.1 C90.1 IC7.57(VSS-TH) IC8.4(GND) IC16.4(GND) LED5.K OSC1.2(OSC2) OSC1.4(OSC3) R35.1 R36.2 R47.1 R50.1 R51.1 R52.1 R55.2 R107.1 R110.1 T1.1(S) T5.2(E)
CTRL_PWR_EN_MOCI: R61.1
CTRL_RESET_MOCI#: D19.C
CTRL_SLEEP_MOCI#: R64.1
HUB_PWR_EN: IC8.5(OE) IC16.7(EN) R61.2 R64.2 R110.2
I2C_1_SCL: IC8.2(A0)
I2C_1_SDA: IC8.3(A1)
I2C_1_USBH_SMCLK: IC7.38(SPI_CLK/SMCLK) R42.2
I2C_1_USBH_SMDAT: IC7.39(SPI_DO/SMDAT) R45.2
SODIMM_155_M: RA2.4 X1.155(USB_1_EN)
SODIMM_157_M: RA2.3 X1.157(USB_1_OC#)
SODIMM_159_M: RA2.2 X1.159(USB_1_VBUS)
SODIMM_161_M: RA2.1 X1.161(USB_1_ID)
SODIMM_185_M: R31.1 X1.185(USB_2_EN)
SODIMM_187_M: R32.1 X1.187(USB_2_OC#)
USB_1_D_N: X1.163(USB_1_D_N)
USB_1_D_P: X1.165(USB_1_D_P)
USB_1_EN: RA2.8
USB_1_ID: RA2.5
USB_1_OC#: RA2.7
USB_1_VBUS: RA2.6
USB_2_D_N: IC7.46(USB2UP_DM) X1.181(USB_2_D_N)
USB_2_D_P: IC7.45(USB2UP_DP) X1.183(USB_2_D_P)
USB_2_EN: R31.2 R35.2 T1.2(G)
USB_2_OC#: R30.1 R32.2
USB_2_SSRX_C_N: C30.1 IC7.48(USB3UP_TXDM)
USB_2_SSRX_C_P: C29.1 IC7.47(USB3UP_TXDP)
USB_2_SSRX_N: C30.2 X1.175(USB_2_SSRX_N)
USB_2_SSRX_P: C29.2 X1.177(USB_2_SSRX_P)
USB_2_SSTX_N: IC7.51(USB3UP_RXDM) X1.169(USB_2_SSTX_N)
USB_2_SSTX_P: IC7.50(USB3UP_RXDP) X1.171(USB_2_SSTX_P)
USBH1_PRT_DIS_M1: IC7.2(USB2DN_DM1/PRT_DIS_M1) R39.1
USBH1_PRT_DIS_P1: IC7.1(USB2DN_DP1/PRT_DIS_P1) R38.1
USBH2_D_N: IC7.9(USB2DN_DM2/PRT_DIS_M2)
USBH2_D_P: IC7.8(USB2DN_DP2/PRT_DIS_P2)
USBH2_PRT_CTL: IC7.35(PRT_CTL2)
USBH2_SSRX_N: IC7.14(USB3DN_RXDM2)
USBH2_SSRX_P: IC7.13(USB3DN_RXDP2)
USBH2_SSTX_C_N: C34.2 IC7.11(USB3DN_TXDM2)
USBH2_SSTX_C_P: C33.2 IC7.10(USB3DN_TXDP2)
USBH2_SSTX_N: C34.1
USBH2_SSTX_P: C33.1
USBH3_D_N: IC7.18(USB2DN_DM3/PRT_DIS_M3)
USBH3_D_P: IC7.17(USB2DN_DP3/PRT_DIS_P3)
USBH3_PRT_CTL: IC7.34(PRT_CTL3)
USBH3_SSRX_N: IC7.23(USB3DN_RXDM3)
USBH3_SSRX_P: IC7.22(USB3DN_RXDP3)
USBH3_SSTX_C_N: C38.2 IC7.20(USB3DN_TXDM3)
USBH3_SSTX_C_P: C36.2 IC7.19(USB3DN_TXDP3)
USBH3_SSTX_N: C38.1
USBH3_SSTX_P: C36.1
USBH4_D_N: IC7.25(USB2DN_DM4/PRT_DIS_M4)
USBH4_D_P: IC7.24(USB2DN_DP4/PRT_DIS_P4)
USBH4_PRT_CTL: IC7.32(PRT_CTL4/GANG_PWR) R54.1 R55.1
USBH_CFG_BC_EN: IC7.40(SPI_DI/CFG_BC_EN) R46.2 R47.2
USBH_CFG_NON_REM: IC7.41(SPI_CE_N/CFG_NON_REM) R49.2 R50.2
USBH_RBIAS: IC7.56(RBIAS) R51.2
USBH_RESET#: C28.2 D18.A D19.A IC7.42(RESET_N) R37.1
USBH_TEST: IC7.52(ATEST) R52.2
USBH_VBUS_DET: IC7.37(VBUS_DET) R34.2 R36.1
NetC35_1: C35.1 OSC1.3(OSC2) R53.1
NetC37_1: C37.1 IC7.54(XTALI/CLK_IN) OSC1.1(OSC1)
NetC60_1: C60.1 R59.1 T3.1(G)
NetC91_1: C91.1 IC16.5(FB) R106.1 R107.2
NetIC7_53: IC7.53(XTALO) R53.2
NetIC8_6: IC8.6(B1) R41.1 R45.1
NetIC8_7: IC8.7(B0) R40.1 R42.1
NetIC16_3: IC16.3(SW) L17.1
NetLED5_A: LED5.A R62.1
NetR33_1: R33.1 T1.5(G) T1.6(D)
NetR34_1: R34.1 T1.3(D)
NetR58_1: R58.1 R59.2 T5.3(C)
NetR63_1: R63.1 T5.1(B)

Not connected (* = marked no-connect by the designer): IC7 3(USB3DN_TXDP1)* 4(USB3DN_TXDM1)* 6(USB3DN_RXDP1)* 7(USB3DN_RXDM1)* 26(USB3DN_TXDP4)* 27(USB3DN_TXDM4)* 29(USB3DN_RXDP4)* 30(USB3DN_RXDM4)* 36(PRT_CTL1)*; IC16 1(NC)* 6(NC)* 8(NC)*

### Buses and harness runs
bus I2C_1[0..1] = port I2C_1[0..1]
bus SYSTEM_CTRL[0..8] = port SYSTEM_CTRL[0..8]
bus USB_OTG[0..5] = port USB_OTG[0..5]
bus USB_SOM[0..7]
bus USBH2[0..6] = port USBH2[0..6]
bus USBH3[0..6] = port USBH3[0..6]
bus USBH4[0..1] = port USBH4[0..1]

### Layout directives
differential pair; differential pair class USB: USB_1_D_N, USB_1_D_P, USB_2_D_N, USB_2_D_P, USB_2_SSRX_C_N, USB_2_SSRX_C_P, USB_2_SSRX_N, USB_2_SSRX_P, USB_2_SSTX_N, USB_2_SSTX_P, USBH2_D_N, USBH2_D_P, USBH2_SSRX_N, USBH2_SSRX_P, USBH2_SSTX_C_N, USBH2_SSTX_C_P, USBH2_SSTX_N, USBH2_SSTX_P, USBH3_D_N, USBH3_D_P, USBH3_SSRX_N, USBH3_SSRX_P, USBH3_SSTX_C_N, USBH3_SSTX_C_P, USBH3_SSTX_N, USBH3_SSTX_P, USBH4_D_N, USBH4_D_P

### Notes on the sheet
- USB5744T-I/2G I²C address
- (near IC7) 0
- (near IC7) 1
- Slave address[7:0]
- (near IC7) R/W
- Pin 1, 2 pulled high
  PORT 1 is disabled
- (near R50) SHARED PADS
- BATTERY CHARGE CONFIGURATION
  R46 200K PORT 1 BC
  R46 10K  PORT 1-3 BC
  R46 10R  RESERVED
  R47 200K NO BC
  R47 10K  PORT 1-2 BC
  R47 10R  PORT 1-4 BC
- NONREMOVABLE PORT CONFIGURATION
  R48 200K PORT 1 NONREMOVABLE
  R48 10K  PORT 1-3 NONREMOVABLE
  R48 10R  RESERVED
  R49 200K ALL PORTS REMOVABLE
  R49 10K  PORT 1-2 NONREMOVABLE
  R49 10R  PORT 1-4 NONREMOVABLE
- When pulled high enables gang mode.
- Title
- Size:
- Date:
- A3
- Number:
- Time:
- Revision:
- Sheet
- of
- File:
- (in symbol IC-Microchip-USB5744T-I/2G) UPSTREAM; DOWNSTREAM - 1; CONTROL; DOWNSTREAM - 2; DOWNSTREAM - 3; OSCILLATOR; POWER; DOWNSTREAM - 4

### Library data of the parts
C27 C29-C34 C36 C38-C42 C47-C54 C60 = C-X7R-100nF-16V-10%-0402: Capacitor Ceramic X7R 100nF 16V 10% 0402; Tolerance: 10%; Type: X7R; Value: 100nF
  C29 C30 C33 C34 C36 C38: Rating: 16V
C28 C46 = C-X5R-10u-6.3V-20%-0402: Capacitor Ceramic X5R 10uF 6.3V 20% 0402; Tolerance: 20%; Type: X5R; Value: 10uF
C35 C37 = C-NP0-12p-50V-5%-0402: Capacitor Ceramic NP0  12pF 50V 5% 0402; Tolerance: 5%; Type: NP0; Value: 12pF
C43 C44 C55 C56 = C-X7R-1nF-50V-10%-0402: Capacitor Ceramic X7R 1nF 50V 10% 0402; Tolerance: 10%; Type: X7R; Value: 1nF
C45 C59 = C-X5R-4.7u-6.3V-20%-0402: Capacitor Ceramic X5R 4.7uF 6.3V 20% 0402; Tolerance: 20%; Type: X5R; Value: 4.7uF
C89 C90 = C-X5R-22uF-10V-20%-0805: Capacitor Ceramic X5R 22uF 10V 20% 0805; Tolerance: 20%; Type: X5R; Value: 22uF; ClassName: Power_Poly
C91 = C-X7R-100pF-50V-10%-0402: Capacitor Ceramic X7R 100pF 50V 10% 0402; Tolerance: 10%; Type: X7R; Value: 100pF
D18 D19 = D-BAT54-SOD523: Schottky Barrier Rectifier; Manufacturer Name: On Semi; Manufacturer Part No.: BAT54XV2T5G
IC7 = IC-Microchip-USB5744T-I/2G: 4-Port SS/HS USB 3.0 Controller Hub, VQFN-56, -40C to +85C; Manufacturer Name: Microchip; Temperature Range: -40C to +85C; Package: QFN-56, Leadless (7mm x 7mm); Manufacturer Part No.: USB5744T-I/2G
IC8 = IC-ONsemi-FXMA2102L8X: Voltage Level Translator for I2C Applications; Manufacturer Name: ONSemi; Manufacturer Part No.: FXMA2102L8X
IC16 = IC-DIODES-PAM2310BECADJR-SOP8: Integrated Buck Regulator; Manufacturer Name: Diodes
L17 = L-Bourns-SRP4020TA-1R2M-1.2uH-4.8A-20%: 1.2µH Shielded Wirewound Inductor 4.8A 30mOhm; Manufacturer Name: Bourns; Tolerance: 20%; I (saturation): 7.8A; Manufacturer Part No.: SRP4020TA-1R2M; I (RMS): 4.8A; Value: 1.2uH; ClassName: Power_Poly
LED5 = LED-LiteOn-LTST-C190GKT: LED green Lite-ON LTST-C190GKT; Manufacturer Name: Lite-ON; Manufacturer Part No.: LTST-C190GKT
OSC1 = OSC-Qantek-QC3225.0000H47R3: 25MHz Crystal Oscillator, Qantek QC3225.0000H47R3, 20ppm, -40C to +85C, 10pF; Tolerance: +/- 20 ppm; Manufacturer Name: QANTEK; Package: 3.2mm X 2.5mm; Temperature Range: -40C to +85C; Value: 25 MHz; Manufacturer Part No.: QC3225.0000H47R3
R30 R33 R35 R36 R110 = R-100K-63mW-5%-0402: Resistor 100 Kohm 63mW 5% 0402; Rating: 63mW; Tolerance: 5%; Value: 100K
R31 R32 = R-22R-63mW-5%-0402: Resistor 22 ohm 63mW 5% 0402; Rating: 63mW; Tolerance: 5%; Value: 22R
R34 R42 R45 R61 R64 = R-0R-63mW-1%-0603: Resistor 0 ohm 63mW 1% 0603; Rating: 63mW; Tolerance: 1%; Value: 0R
R37 R40 R41 R58 R59 R63 = R-10K-63mW-5%-0402: Resistor 10 Kohm 63mW 5% 0402; Rating: 63mW; Tolerance: 5%; Value: 10K
R38 R39 R52 R62 = R-1K-63mW-5%-0402: Resistor 1 Kohm 63mW 5% 0402; Rating: 63mW; Tolerance: 5%; Value: 1K
R46 R47 R49 R50 = R-200K-63mW-5%-0603: Resistor 200 Kohm 63mW 5% 0603; Rating: 63mW; Tolerance: 5%; Value: 200K
R51 = R-12K-63mW-1%-0402: Resistor 12 Kohm 63mW 1% 0402; Rating: 63mW; Tolerance: 1%; Value: 12K
R53 = R-10R-63mW-5%-0402: Resistor 10 ohm 63mW 5% 0402; Rating: 63mW; Tolerance: 5%; Value: 10R
R54 R55 = R-10K-63mW-5%-0603: Resistor 10 Kohm 63mW 5% 0603; Rating: 63mW; Tolerance: 5%; Value: 10K
R106 R107 = R-150K-63mW-1%-0402: Resistor 150 Kohm 63mW 1% 0402; Value: 150KR; Rating: 63mW; Tolerance: 1%
RA2 = RA-22R-63mW-5%-1206-div: Resistor Array 22 R 63mW 5% 1206; Tolerance: 5%; Power Dissipation: 63mW; Value: 22R
T1 = T-ONSemi-NTZD3155CT1G: N- and P-Channel MOSFET 20V; Manufacturer Name: ONSemi; Manufacturer Part No.: NTZD3155CT1G
T3 = T-IR-IRLML6401PbF-SOT-23: p-channel MOSFET, IRLML6401PbF; Manufacturer Name: International Rectifier; Manufacturer Part No.: IRLML6401PbF
T5 = T-ONSemi-MMBT5551LT1G -SOT-23: Bipolar Transistor NPN 160V 600mA  225mW Surface Mount SOT-23-3; Manufacturer Name: ONSemi; Manufacturer Part No.: MMBT5551LT1G
X1 = CON-TE-2309409-2: as X1 on sheet CAN; Temperature Range: -40C to +125C; Package: DDR4-SODIMM-260; Manufacturer Part No.: 2309409-2

## Sheet USB_Connectors.SchDoc: Dahlia Carrier Board
size A3; Organization: Toradex AG; Address1: Ebenaustrasse 10; Address2: Horw; Address3: 6048; Address4: Switzerland; DocumentNumber: 6; Revision: V1.1; SheetNumber: 6; SheetTotal: 21; PageSetup: Record=PageOptions|CenterHorizontal=True|CenterVertical=True|PrintScale=0.71|XCorrection=1.00|YCorrection=1.00|PrintKind=1|BorderSize=5000000|LeftOffset=0|BottomOffset=0|Orientation=2|PaperLength=1000|PaperWidth=1000|Scale=100|PaperSource=15|PrintQuality=600|MediaType=1|DitherType=10|PaperKind=A4|PrintScaleMode=1
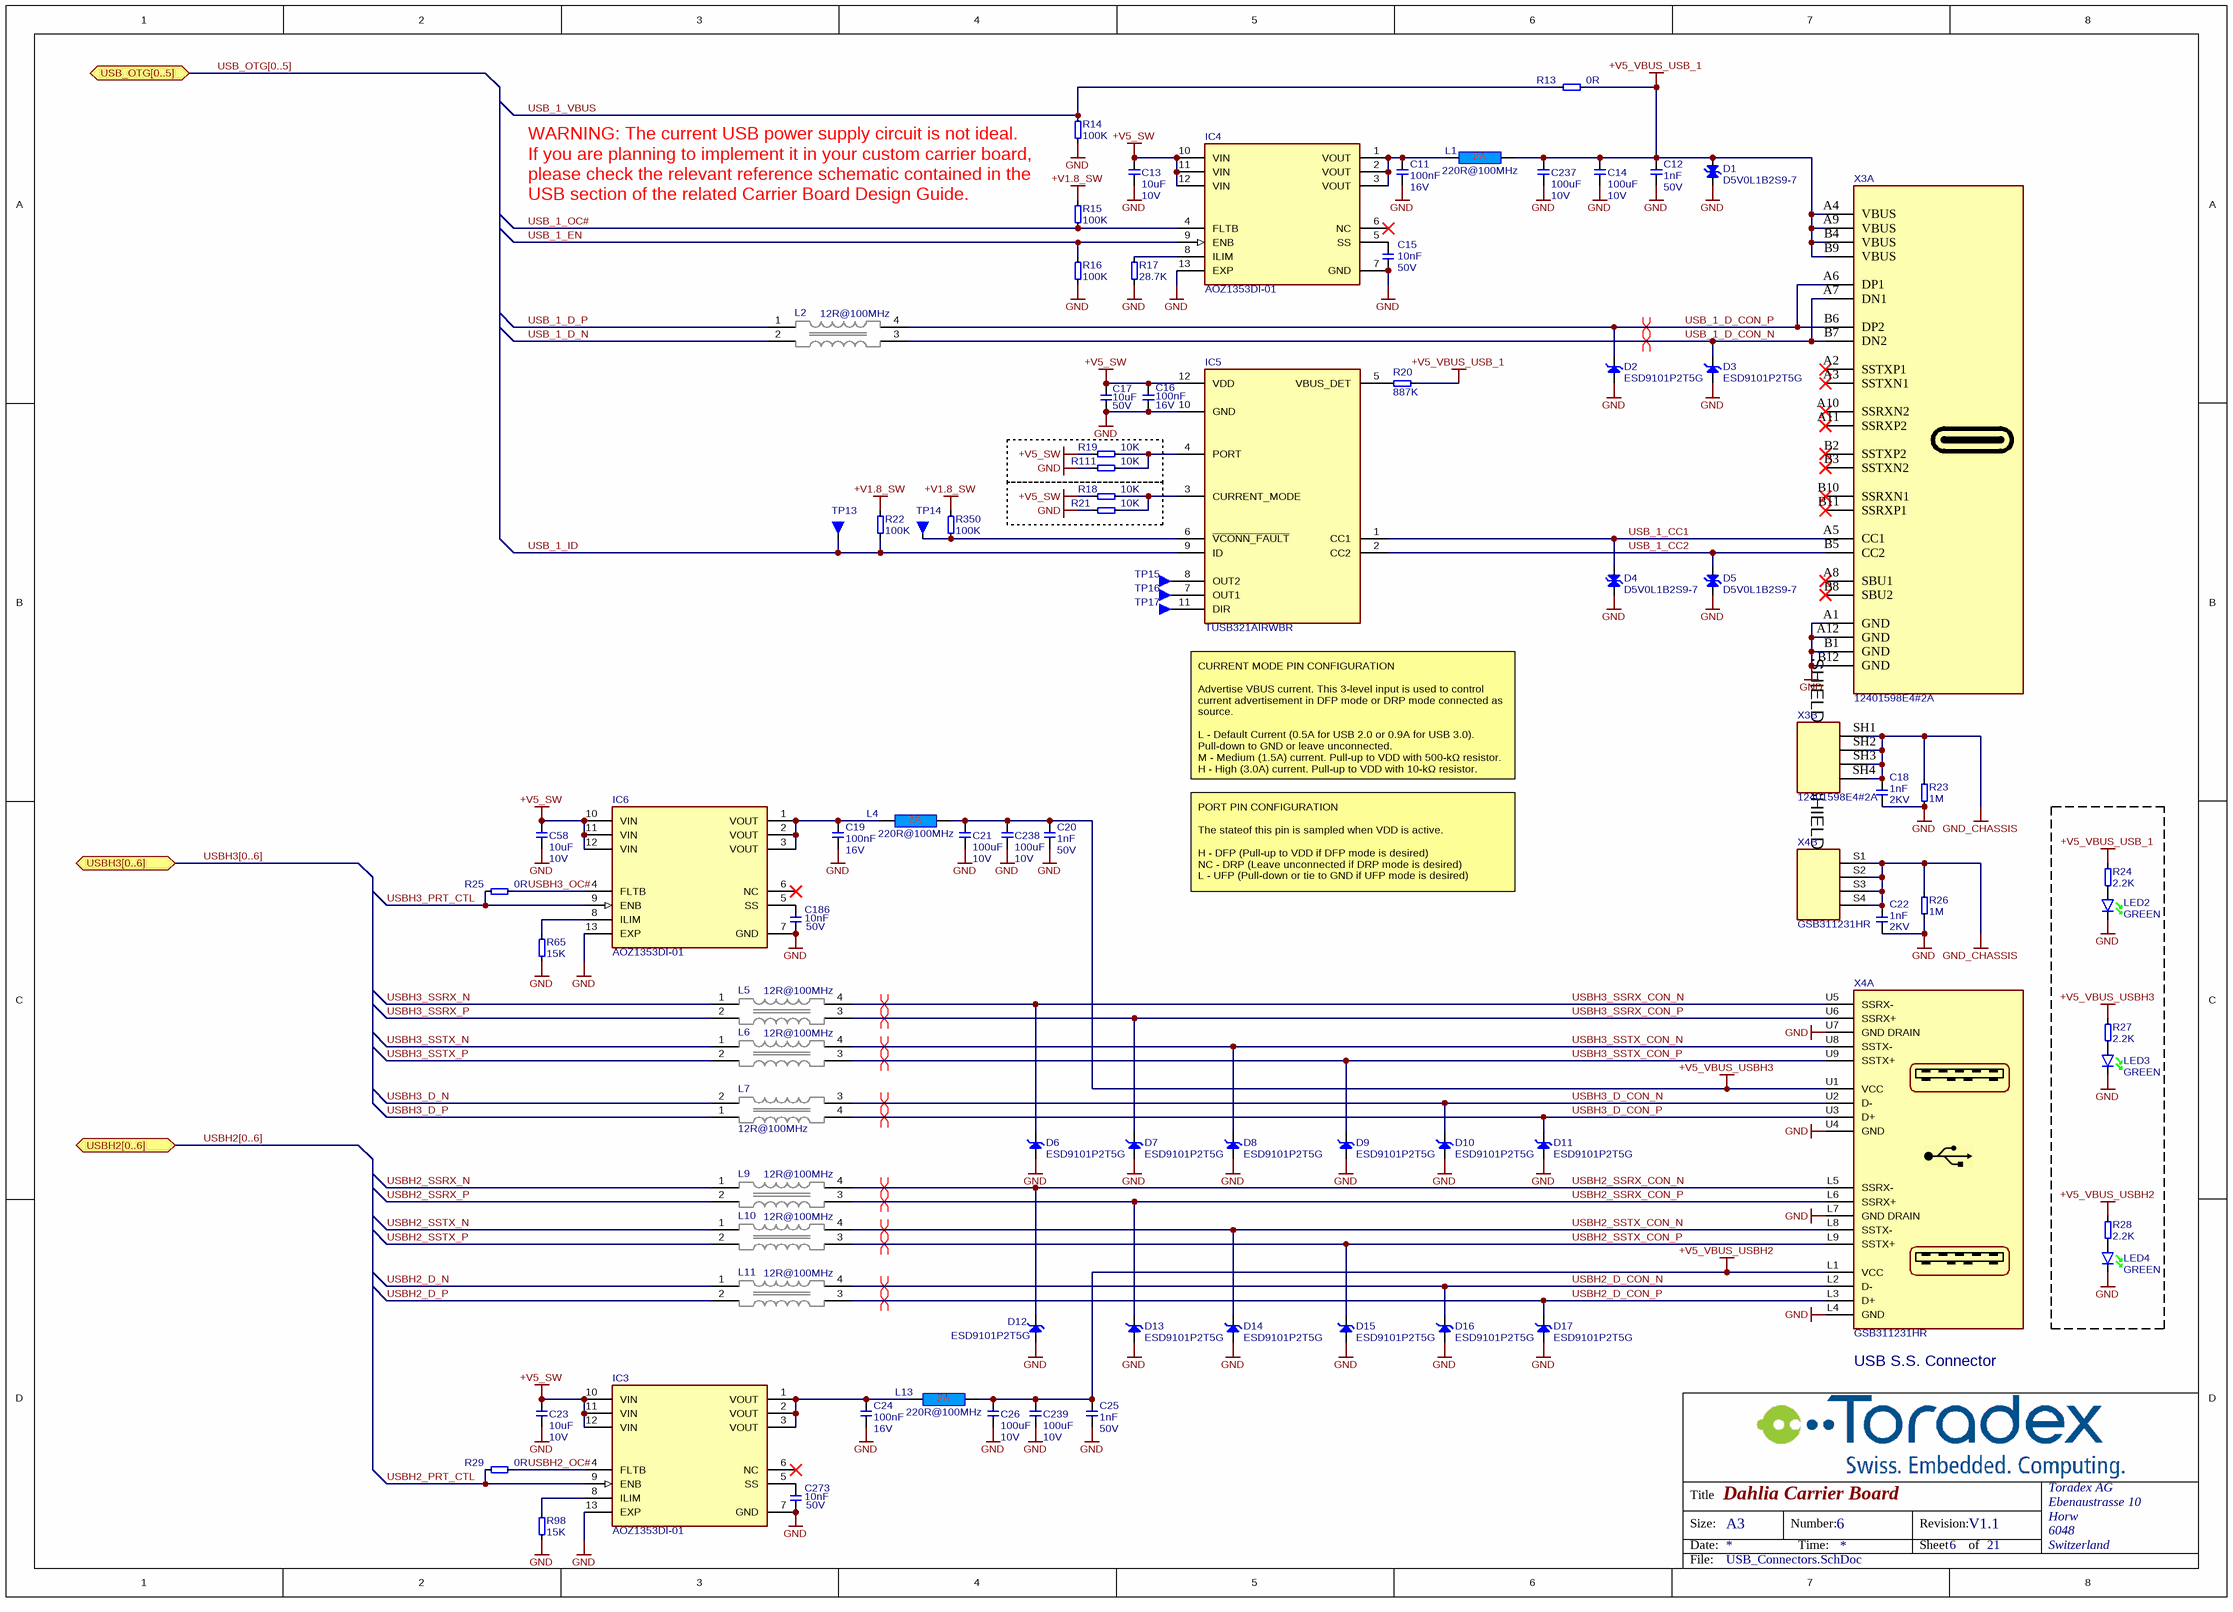
[diagram p5: USB_Connectors.SchDoc]

### Parts
C11  Rating: 16V  [CAPC1005X60N]  (hidden comment: 100nF)
C12  Rating: 50V  [CAPC1005X60N]  (hidden comment: 1nF)
C13  Rating: 10V  [T_CAPC0603X33N]  (hidden comment: 10uF)
C14  Rating: 10V  [T_CAPC1206X60N]  (hidden comment: 100uF)
C15  Rating: 50V  [CAPC1005X60N]  (hidden comment: 10nF)
C16  Rating: 16V  [CAPC1005X60N]  (hidden comment: 100nF)
C17  Rating: 50V  [T_CAPC1206X60N]  (hidden comment: 10uF)
C18  Rating: 2KV  [T_CAPC1206X180N]  (hidden comment: 1nF)
C19  Rating: 16V  [CAPC1005X60N]  (hidden comment: 100nF)
C20  Rating: 50V  [CAPC1005X60N]  (hidden comment: 1nF)
C21  Rating: 10V  [T_CAPC1206X60N]  (hidden comment: 100uF)
C22  Rating: 2KV  [T_CAPC1206X180N]  (hidden comment: 1nF)
C23  Rating: 10V  [T_CAPC0603X33N]  (hidden comment: 10uF)
C24  Rating: 16V  [CAPC1005X60N]  (hidden comment: 100nF)
C25  Rating: 50V  [CAPC1005X60N]  (hidden comment: 1nF)
C26  Rating: 10V  [T_CAPC1206X60N]  (hidden comment: 100uF)
C58  Rating: 10V  [T_CAPC0603X33N]  (hidden comment: 10uF)
C186  Rating: 50V  [CAPC1005X60N]  (hidden comment: 10nF)
C237  Rating: 10V  [T_CAPC1206X60N]  (hidden comment: 100uF)
C238  Rating: 10V  [T_CAPC1206X60N]  (hidden comment: 100uF)
C239  Rating: 10V  [T_CAPC1206X60N]  (hidden comment: 100uF)
C273  Rating: 50V  [CAPC1005X60N]  (hidden comment: 10nF)
D1  D5V0L1B2S9-7  [D-DIODES-SOD-923]
D2  ESD9101P2T5G  [SOD-923]
D3  ESD9101P2T5G  [SOD-923]
D4  D5V0L1B2S9-7  [D-DIODES-SOD-923]
D5  D5V0L1B2S9-7  [D-DIODES-SOD-923]
D6  ESD9101P2T5G  [SOD-923]
D7  ESD9101P2T5G  [SOD-923]
D8  ESD9101P2T5G  [SOD-923]
D9  ESD9101P2T5G  [SOD-923]
D10  ESD9101P2T5G  [SOD-923]
D11  ESD9101P2T5G  [SOD-923]
D12  ESD9101P2T5G  [SOD-923]
D13  ESD9101P2T5G  [SOD-923]
D14  ESD9101P2T5G  [SOD-923]
D15  ESD9101P2T5G  [SOD-923]
D16  ESD9101P2T5G  [SOD-923]
D17  ESD9101P2T5G  [SOD-923]
IC3  AOZ1353DI-01  [IC-A&O-AOZ1353DI-01]
IC4  AOZ1353DI-01  [IC-A&O-AOZ1353DI-01]
IC5  TUSB321AIRWBR  [IC-TI-TUSB321AIRWBR]
IC6  AOZ1353DI-01  [IC-A&O-AOZ1353DI-01]
L1  220R@100MHz  [INDC1608X95N]
L2  12R@100MHz  [T_Panasonic_EXC14CH120U]
L4  220R@100MHz  [INDC1608X95N]
L5  12R@100MHz  [T_Panasonic_EXC14CH120U]
L6  12R@100MHz  [T_Panasonic_EXC14CH120U]
L7  12R@100MHz  [T_Panasonic_EXC14CH120U]
L9  12R@100MHz  [T_Panasonic_EXC14CH120U]
L10  12R@100MHz  [T_Panasonic_EXC14CH120U]
L11  12R@100MHz  [T_Panasonic_EXC14CH120U]
L13  220R@100MHz  [INDC1608X95N]
LED2  Color: GREEN  [T_Liteon_LTST-C190GKT]  (hidden comment: LTST-C190GKT)
LED3  Color: GREEN  [T_Liteon_LTST-C190GKT]  (hidden comment: LTST-C190GKT)
LED4  Color: GREEN  [T_Liteon_LTST-C190GKT]  (hidden comment: LTST-C190GKT)
R13  0R  [T_RESC0603X30N]
R14  100K  [RESC1005X40N]
R15  100K  [RESC1005X40N]
R16  100K  [RESC1005X40N]
R17  28.7K  [T_RESC0603X30N]
R18  10K  [T_RESC0603X30N]
R19  10K  [T_RESC0603X30N]
R20  887K  [RESC1005X40N]
R21  10K  [T_RESC0603X30N]
R22  100K  [RESC1005X40N]
R23  1M  [RESC3216X75N]
R24  2.2K  [RESC1005X40N]
R25  0R  [T_RESC0603X30N]
R26  1M  [RESC3216X75N]
R27  2.2K  [RESC1005X40N]
R28  2.2K  [RESC1005X40N]
R29  0R  [T_RESC0603X30N]
R65  15K  [RESC1005X40N]
R98  15K  [RESC1005X40N]
R111  10K  [T_RESC0603X30N]
R350  100K  [RESC1005X40N]
TP13  Testpin-SMD  [T_TP-SMD]  (value not drawn)  (no BOM)
TP14  Testpin-SMD  [T_TP-SMD]  (value not drawn)  (no BOM)
TP15  Testpin-SMD  [T_TP-SMD]  (value not drawn)  (no BOM)
TP16  Testpin-SMD  [T_TP-SMD]  (value not drawn)  (no BOM)
TP17  Testpin-SMD  [T_TP-SMD]  (value not drawn)  (no BOM)
X3  12401598E4#2A  [CON-AMPHENOL-12401598E4#2A]  (parts A,B of 2)
X4  GSB311231HR  [T_AMPHENOL_ GSB311231HR]  (parts A,B of 2)

### Ports
USB_OTG[0..5] (bidir), USBH2[0..6] (bidir), USBH3[0..6] (bidir)

### Nets
+V1.8_SW: R15.2 R22.2 R350.1
+V5_SW: C13.2 C16.2 C17.2 C23.2 C58.2 IC3.10(VIN) IC3.11(VIN) IC3.12(VIN) IC4.10(VIN) IC4.11(VIN) IC4.12(VIN) IC5.12(VDD) IC6.10(VIN) IC6.11(VIN) IC6.12(VIN) R18.2 R19.2
+V5_VBUS_USB_1: C12.2 C14.2 C237.2 D1.2(A) L1.2 R13.2 R20.2 R24.1 X3.A4(VBUS) X3.A9(VBUS) X3.B4(VBUS) X3.B9(VBUS)
+V5_VBUS_USBH2: C25.2 C26.2 C239.2 L13.2 R28.1 X4.L1(VCC)
+V5_VBUS_USBH3: C20.2 C21.2 C238.2 L4.2 R27.1 X4.U1(VCC)
GND: C11.1 C12.1 C13.1 C14.1 C15.1 C16.1 C17.1 C18.1 C19.1 C20.1 C21.1 C22.1 C23.1 C24.1 C25.1 C26.1 C58.1 C186.1 C237.1 C238.1 C239.1 C273.1 D1.1(C) D2.2(A) D3.2(A) D4.1(C) D5.1(C) D6.2(A) D7.2(A) D8.2(A) D9.2(A) D10.2(A) D11.2(A) D12.2(A) D13.2(A) D14.2(A) D15.2(A) D16.2(A) D17.2(A) IC3.7(GND) IC3.13(EXP) IC4.7(GND) IC4.13(EXP) IC5.10(GND) IC6.7(GND) IC6.13(EXP) LED2.K LED3.K LED4.K R14.2 R16.1 R17.1 R21.2 R23.1 R26.1 R65.1 R98.1 R111.2 X3.A1(GND) X3.A12(GND) X3.B1(GND) X3.B12(GND) X4.L4(GND) X4.L7(GND_DRAIN) X4.U4(GND) X4.U7(GND_DRAIN)
GND_CHASSIS: C18.2 C22.2 R23.2 R26.2 X3.SH1(SHIELD) X3.SH2(SHIELD) X3.SH3(SHIELD) X3.SH4(SHIELD) X4.S1(SHIELD) X4.S2(SHIELD) X4.S3(SHIELD) X4.S4(SHIELD)
USB_1_CC1: D4.2(A) IC5.1(CC1) X3.A5(CC1)
USB_1_CC2: D5.2(A) IC5.2(CC2) X3.B5(CC2)
USB_1_D_CON_N: D3.1(C) L2.3 X3.A7(DN1) X3.B7(DN2)
USB_1_D_CON_P: D2.1(C) L2.4 X3.A6(DP1) X3.B6(DP2)
USB_1_D_N: L2.2
USB_1_D_P: L2.1
USB_1_EN: IC4.9(ENB) R16.2
USB_1_ID: IC5.9(ID) R22.1 TP13.1
USB_1_OC#: IC4.4(FLTB) R15.1
USB_1_VBUS: R13.1 R14.1
USBH2_D_CON_N: D16.1(C) L11.4 X4.L2(D-)
USBH2_D_CON_P: D17.1(C) L11.3 X4.L3(D+)
USBH2_D_N: L11.1
USBH2_D_P: L11.2
USBH2_OC#: IC3.4(FLTB) R29.2
USBH2_PRT_CTL: IC3.9(ENB) R29.1
USBH2_SSRX_CON_N: D12.1(C) L9.4 X4.L5(SSRX-)
USBH2_SSRX_CON_P: D13.1(C) L9.3 X4.L6(SSRX+)
USBH2_SSRX_N: L9.1
USBH2_SSRX_P: L9.2
USBH2_SSTX_CON_N: D14.1(C) L10.4 X4.L8(SSTX-)
USBH2_SSTX_CON_P: D15.1(C) L10.3 X4.L9(SSTX+)
USBH2_SSTX_N: L10.1
USBH2_SSTX_P: L10.2
USBH3_D_CON_N: D10.1(C) L7.3 X4.U2(D-)
USBH3_D_CON_P: D11.1(C) L7.4 X4.U3(D+)
USBH3_D_N: L7.2
USBH3_D_P: L7.1
USBH3_OC#: IC6.4(FLTB) R25.2
USBH3_PRT_CTL: IC6.9(ENB) R25.1
USBH3_SSRX_CON_N: D6.1(C) L5.4 X4.U5(SSRX-)
USBH3_SSRX_CON_P: D7.1(C) L5.3 X4.U6(SSRX+)
USBH3_SSRX_N: L5.1
USBH3_SSRX_P: L5.2
USBH3_SSTX_CON_N: D8.1(C) L6.4 X4.U8(SSTX-)
USBH3_SSTX_CON_P: D9.1(C) L6.3 X4.U9(SSTX+)
USBH3_SSTX_N: L6.1
USBH3_SSTX_P: L6.2
NetC11_2: C11.2 IC4.1(VOUT) IC4.2(VOUT) IC4.3(VOUT) L1.1
NetC15_2: C15.2 IC4.5(SS)
NetC19_2: C19.2 IC6.1(VOUT) IC6.2(VOUT) IC6.3(VOUT) L4.1
NetC24_2: C24.2 IC3.1(VOUT) IC3.2(VOUT) IC3.3(VOUT) L13.1
NetC186_2: C186.2 IC6.5(SS)
NetC273_2: C273.2 IC3.5(SS)
NetIC3_8: IC3.8(ILIM) R98.2
NetIC4_8: IC4.8(ILIM) R17.2
NetIC5_3: IC5.3(CURRENT_MODE) R18.1 R21.1
NetIC5_4: IC5.4(PORT) R19.1 R111.1
NetIC5_5: IC5.5(VBUS_DET) R20.1
NetIC5_6: IC5.6(~{VCONN_FAULT}) R350.2 TP14.1
NetIC5_7: IC5.7(OUT1) TP16.1
NetIC5_8: IC5.8(OUT2) TP15.1
NetIC5_11: IC5.11(DIR) TP17.1
NetIC6_8: IC6.8(ILIM) R65.2
NetLED2_A: LED2.A R24.2
NetLED3_A: LED3.A R27.2
NetLED4_A: LED4.A R28.2

Not connected (* = marked no-connect by the designer): IC3 6(NC)*; IC4 6(NC)*; IC6 6(NC)*; X3 A2(SSTXP1)* A3(SSTXN1)* A8(SBU1)* A10(SSRXN2)* A11(SSRXP2)* B2(SSTXP2)* B3(SSTXN2)* B8(SBU2)* B10(SSRXN1)* B11(SSRXP1)*

### Buses and harness runs
bus USB_OTG[0..5] = port USB_OTG[0..5]
bus USBH2[0..6] = port USBH2[0..6]
bus USBH3[0..6] = port USBH3[0..6]

### Layout directives
differential pair; differential pair class USB: USB_1_D_CON_N, USB_1_D_CON_P, USBH2_D_CON_N, USBH2_D_CON_P, USBH2_SSRX_CON_N, USBH2_SSRX_CON_P, USBH2_SSTX_CON_N, USBH2_SSTX_CON_P, USBH3_D_CON_N, USBH3_D_CON_P, USBH3_SSRX_CON_N, USBH3_SSRX_CON_P, USBH3_SSTX_CON_N, USBH3_SSTX_CON_P

### Notes on the sheet
- WARNING: The current USB power supply circuit is not ideal.
  If you are planning to implement it in your custom carrier board, please check the relevant reference schematic contained in the USB section of the related Carrier Board Design Guide.
- CURRENT MODE PIN CONFIGURATION
  Advertise VBUS current. This 3-level input is used to control current advertisement in DFP mode or DRP mode connected as source.
  L - Default Current (0.5A for USB 2.0 or 0.9A for USB 3.0). Pull-down to GND or leave unconnected.
  M - Medium (1.5A) current. Pull-up to VDD with 500-kΩ resistor.
  H - High (3.0A) current. Pull-up to VDD with 10-kΩ resistor.
- PORT PIN CONFIGURATION
  The stateof this pin is sampled when VDD is active.
  H - DFP (Pull-up to VDD if DFP mode is desired)
  NC - DRP (Leave unconnected if DRP mode is desired)
  L - UFP (Pull-down or tie to GND if UFP mode is desired)
- (near X4) USB S.S. Connector
- Title
- Size:
- Date:
- A3
- Number:
- Time:
- Revision:
- Sheet
- of
- File:

### Library data of the parts
C11 C16 C19 C24 = C-X7R-100nF-16V-10%-0402: Capacitor Ceramic X7R 100nF 16V 10% 0402; Tolerance: 10%; Type: X7R; Value: 100nF
C12 C20 C25 = C-X7R-1nF-50V-10%-0402: Capacitor Ceramic X7R 1nF 50V 10% 0402; Tolerance: 10%; Type: X7R; Value: 1nF
C13 C23 C58 = C-X5R-10uF-10V-20%-0603: Capacitor Ceramic X5R 10uF 10V 20% 0603; Tolerance: 20%; Type: X5R; Value: 10uF
C14 C21 C26 C237-C239 = C-X5R-100uF-10V-20%-1206: Capacitor Ceramic X5R 100uF 10V 20% 1206; Tolerance: 20%; Type: X5R; Value: 100uF
C15 C186 C273 = C-X7R-10nF-50V-10%-0402: Capacitor Ceramic X7R 10nF 50V 10% 0402; Tolerance: 10%; Type: X7R; Value: 10nF
C17 = C-X5R-10uF-50V-20%-1206: Capacitor Ceramic X5R 10uF 50V 20% 1206; Tolerance: 20%; Type: X5R; Value: 10uF
C18 C22 = C-X7R-1nF-2KV-10%-1206: Capacitor Ceramic X7R 1nF 2KV 10% 1206; Tolerance: 10%; Type: X7R; Value: 1nF
D1 D4 D5 = D-Diodes-D5V0L1B2S9-7: BIDIRECTIONAL TVS DIODE 5V  SOD923; Manufacturer Name: Diodes; Manufacturer Part No.: D5V0L1B2S9-7
D2 D3 D6-D17 = D-OnSemi-ESD9101P2T5G: ESD Protection Diode; Manufacturer Name: OnSemi; Manufacturer Part No.: ESD9101P2T5G
IC3 IC4 IC6 = IC-A&O-AOZ1353DI-01: 5V/3A  Smart Current Limited Load Switch with True Reverse Current Blocking; Manufacturer Name: Alpha and Omega; Manufacturer Part No.: AOZ1353DI-01
IC5 = IC-TI-TUSB321AIRWBR: USB Type-C Configuration Channel Logic and Port Control with VCON; Manufacturer Name: Texas Instruments; Manufacturer Part No.: TUSB321AIRWBR
L1 L4 L13 = L-220R@100MHz-2A-25%-0603: 220R@100MHz 2A EMI FILTER; Tolerance: 25%; Rating: 2A; Value: 220R@100MHz
L2 L5-L7 L9-L11 = L-Panasonic-EXC14CH120U-12R@100MHz-1000mA-25%: Common Mode Choke High Speed 12R 100mA; Tolerance: 25%; Rating: 100mA; Manufacturer Name: Panasonic; Manufacturer Part No.: EXC14CH120U; Value: 12R@100MHz
LED2-LED4 = LED-LiteOn-LTST-C190GKT: LED green Lite-ON LTST-C190GKT; Manufacturer Name: Lite-ON; Manufacturer Part No.: LTST-C190GKT
R13 R25 R29 = R-0R-63mW-1%-0603: Resistor 0 ohm 63mW 1% 0603; Rating: 63mW; Tolerance: 1%; Value: 0R
R14-R16 R22 R350 = R-100K-63mW-5%-0402: Resistor 100 Kohm 63mW 5% 0402; Rating: 63mW; Tolerance: 5%; Value: 100K
R17 = R-28.7K-63mW-1%-0603: Resistor 28.7 Kohm 63mW 1% 0603; Rating: 63mW; Tolerance: 1%; Value: 28.7K
R18 R19 R21 R111 = R-10K-63mW-5%-0603: Resistor 10 Kohm 63mW 5% 0603; Rating: 63mW; Tolerance: 5%; Value: 10K
R20 = R-887K-63mW-1%-0402: Resistor 887 Kohm 63mW 1% 0402; Rating: 63mW; Tolerance: 1%; Value: 887K
R23 R26 = R-1M-250mW-5%-1206: Resistor 1 Mohm 250mW 5% 1206; Rating: 250mW; Tolerance: 5%; Value: 1M
R24 R27 R28 = R-2.2K-63mW-5%-0402: Resistor 2.2 Kohm 63mW 5% 0402; Value: 2.2KR; Rating: 63mW; Tolerance: 5%
R65 R98 = R-15KR-63mW-1%-0402: Resistor 15 Kohm 63mW 1% 0402; Value: 15KR; Rating: 63mW; Tolerance: 1%
TP13-TP17 = Testpin-SMD: Testpin SMD
X3 = CON-Amphenol-12401598E4#2A: USB 3.1 Gen 2, Input Output Connectors, USB type C, Receptacle, Top mount, dual-row SMT, 1.6mmPCB; No. of ways: 24; Manufacturer Name: Amphenol; Manufacturer Part No.: 12401598E4#2A
X4 = CON-Amphenol-GSB311231HR: USB 3.0 double row, Type A; No. of ways: 18; Manufacturer Name: Amphenol; Manufacturer Part No.: GSB311231HR